# Altium project CATS-Vega.PrjPcb
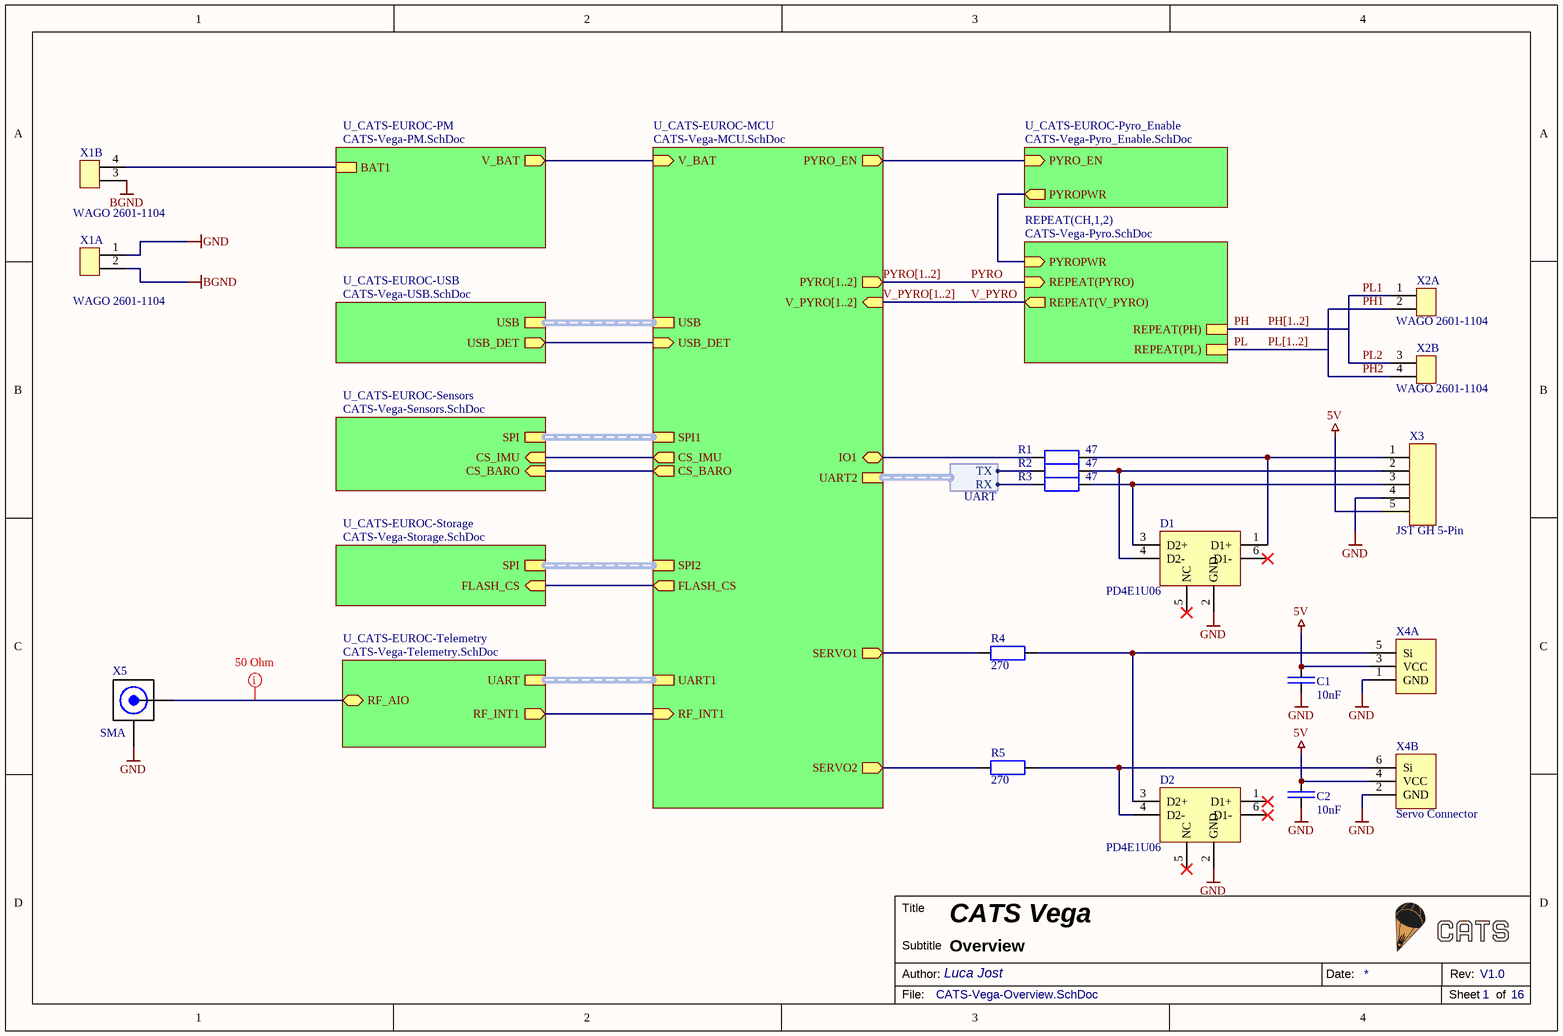
[diagram p0: CATS-Vega-Overview.SchDoc]
16 sheets, 177 parts. Net scope: hierarchical (ports join the sheet entries above them; power ports are global).
Board files: CATS-Vega.PcbDoc, CATS-Vega-Nutzen.PcbDoc
Sheets:
  CATS-Vega-Overview.SchDoc
    U_CATS-EUROC-Sensors = CATS-Vega-Sensors.SchDoc
      U_CATS-EUROC-IMU = CATS-Vega-IMU.SchDoc
      U_CATS-EUROC-Baro = CATS-Vega-Baro.SchDoc
    U_CATS-EUROC-MCU = CATS-Vega-MCU.SchDoc
    CH1 = CATS-Vega-Pyro.SchDoc
    CH2 = CATS-Vega-Pyro.SchDoc
    U_CATS-EUROC-USB = CATS-Vega-USB.SchDoc
    U_CATS-EUROC-Pyro_Enable = CATS-Vega-Pyro_Enable.SchDoc
    U_CATS-EUROC-Storage = CATS-Vega-Storage.SchDoc
    U_CATS-EUROC-PM = CATS-Vega-PM.SchDoc
    U_CATS-EUROC-Telemetry = CATS-Vega-Telemetry.SchDoc
      U_MCU = CATS-Vega-Radio_MCU.SchDoc
      U_RF = CATS-Vega-RF.SchDoc
        U_Frontend = CATS-Vega-Frontend.SchDoc
        U_Radio = CATS-Vega-Radio.SchDoc
      U_GNSS = CATS-Vega-GNSS.SchDoc

## Sheet CATS-Vega-Overview.SchDoc: CATS Vega
size A4; DocumentNumber: Overview; Revision: V1.0; SheetNumber: 1; SheetTotal: 16; Author: Luca Jost; Subtitle: Overview

### Parts
C1  10nF  [SMD Keramikkondensator 0603]
C2  10nF  [SMD Keramikkondensator 0603]
D1  PD4E1U06  [SMD IC SOT-363 (SC-70-6)]
D2  PD4E1U06  [SMD IC SOT-363 (SC-70-6)]
R1  47  [SMD Widerstand 0603]
R2  47  [SMD Widerstand 0603]
R3  47  [SMD Widerstand 0603]
R4  270  [SMD Widerstand 0603]
R5  270  [SMD Widerstand 0603]
X1  WAGO 2601-1104  [THT PCB Terminal WAGO 2601-1104]  (parts A,B of 2)
X2  WAGO 2601-1104  [THT PCB Terminal WAGO 2601-1104]  (parts A,B of 2)
X3  JST GH 5-Pin  [SMD Connector JST GH-5]
X4  Servo Connector  [THT Stiftleiste 6-Pol (2x3) 90°]  (value not drawn)  (parts A,B of 2)
X5  SMA  [THT Buchse SMA Female]

### Sub-sheets
REPEAT(CH,1,2) = CATS-Vega-Pyro.SchDoc: REPEAT(V_PYRO) (out), REPEAT(PYRO) (in), REPEAT(PH), REPEAT(PL), PYROPWR (in)
U_CATS-EUROC-MCU = CATS-Vega-MCU.SchDoc: SPI1 (harness SPI), UART1 (harness UART), USB (harness USB), V_PYRO[1..2] (in), PYRO[1..2] (out), IO1 (bidir), SERVO1 (out), SERVO2 (out), USB_DET (in), V_BAT (in), CS_IMU (out), CS_BARO (out), RF_INT1 (in), PYRO_EN (out), SPI2 (harness SPI), FLASH_CS (out), UART2 (harness UART)
U_CATS-EUROC-PM = CATS-Vega-PM.SchDoc: V_BAT (out), BAT1
U_CATS-EUROC-Pyro_Enable = CATS-Vega-Pyro_Enable.SchDoc: PYRO_EN (in), PYROPWR (out)
U_CATS-EUROC-Sensors = CATS-Vega-Sensors.SchDoc: CS_IMU (in), SPI, CS_BARO (in)
U_CATS-EUROC-Storage = CATS-Vega-Storage.SchDoc: SPI (harness SPI), FLASH_CS (in)
U_CATS-EUROC-Telemetry = CATS-Vega-Telemetry.SchDoc: UART, RF_INT1 (out), RF_AIO (bidir)
U_CATS-EUROC-USB = CATS-Vega-USB.SchDoc: USB (harness USB), USB_DET (out)

### Harnesses
UART: TX, RX

### Nets
5V: C1.2 C2.2 X3.5 X4.3(VCC) X4.4(VCC)
BGND: X1.2 X1.3
GND: C1.1 C2.1 D1.2(GND) D2.2(GND) X1.1 X3.4 X4.1(GND) X4.2(GND) X5.2(RF)
CS_BARO: sheet U_CATS-EUROC-Sensors/CS_BARO, sheet U_CATS-EUROC-MCU/CS_BARO
CS_IMU: sheet U_CATS-EUROC-Sensors/CS_IMU, sheet U_CATS-EUROC-MCU/CS_IMU
FLASH_CS: sheet U_CATS-EUROC-MCU/FLASH_CS, sheet U_CATS-EUROC-Storage/FLASH_CS
INT1: sheet U_CATS-EUROC-MCU/RF_INT1, sheet U_CATS-EUROC-Telemetry/RF_INT1
IO1: R1.1 ; sheet U_CATS-EUROC-MCU/IO1
PH: sheet REPEAT(CH,1,2)/REPEAT(PH)
PH1: X2.2 X2.4 ; sheet REPEAT(CH,1,2)/PYROPWR, sheet U_CATS-EUROC-Pyro_Enable/PYROPWR  [also labelled PH2]
PL: sheet REPEAT(CH,1,2)/REPEAT(PL)
PL1: X2.1
PL2: X2.3
PYRO: sheet REPEAT(CH,1,2)/REPEAT(PYRO)
PYRO_EN: sheet U_CATS-EUROC-MCU/PYRO_EN, sheet U_CATS-EUROC-Pyro_Enable/PYRO_EN
SERVO1: R4.1 ; sheet U_CATS-EUROC-MCU/SERVO1
SERVO2: R5.1 ; sheet U_CATS-EUROC-MCU/SERVO2
UART2_RX: R3.1 ; sheet U_CATS-EUROC-MCU/UART2.RX
UART2_TX: R2.1 ; sheet U_CATS-EUROC-MCU/UART2.TX
USB_DET: sheet U_CATS-EUROC-MCU/USB_DET, sheet U_CATS-EUROC-USB/USB_DET
V_BAT: sheet U_CATS-EUROC-MCU/V_BAT, sheet U_CATS-EUROC-PM/V_BAT
V_PYRO: sheet REPEAT(CH,1,2)/REPEAT(V_PYRO)
NetC30_2: X1.4 ; sheet U_CATS-EUROC-PM/BAT1
NetD1_1: D1.1(D1+) R1.2 X3.1
NetD1_3: D1.3(D2+) R3.2 X3.3
NetD1_4: D1.4(D2-) R2.2 X3.2
NetD2_3: D2.3(D2+) R4.2 X4.5(Si)
NetD2_4: D2.4(D2-) R5.2 X4.6(Si)
NetFL1_3: X5.1(RF) ; sheet U_CATS-EUROC-Telemetry/RF_AIO

Not connected (* = marked no-connect by the designer): D1 5(NC)* 6(D1-)*; D2 1(D1+)* 5(NC)* 6(D1-)*

### Buses and harness runs
bus PH[1..2]
bus PL[1..2]
bus PYRO[1..2] = sheet U_CATS-EUROC-MCU/PYRO[1..2]
bus V_PYRO[1..2] = sheet U_CATS-EUROC-MCU/V_PYRO[1..2]
harness sheet U_CATS-EUROC-MCU/SPI1 = sheet U_CATS-EUROC-Sensors/SPI
harness sheet U_CATS-EUROC-MCU/SPI2 = sheet U_CATS-EUROC-Storage/SPI
harness sheet U_CATS-EUROC-MCU/UART1 = sheet U_CATS-EUROC-Telemetry/UART
harness sheet U_CATS-EUROC-MCU/USB = sheet U_CATS-EUROC-USB/USB

### Layout directives
rule Impedance Constraint [Min = 50.00    Max = 50.00    ]; net class RF-Line 50: NetFL1_3

### Notes on the sheet
- Title
- Author:
- Subtitle
- Date:
- Rev:
- File:
- Sheet
- of

### Library data of the parts
C1 C2 = E6 - 10nF: SMD Ceramic Capacitor E6; Unit Price: 0.0015; JLC: C1589
D1 D2 = PD4E1U06DCKR: Unidirectional 3A (8/20us) 15V (Typ) 6.5V 5.5V (Max) SOT-363 ESD Protection Devices ROHS; ComponentLink1Description: Datasheet; ComponentLink1URL: https://datasheet.lcsc.com/lcsc/1810172210_Texas-Instruments-TPD4E1U06DCKR_C194628.pdf; Digikey: 296-39347-1-ND; Farnell: 3116516; JLC: C194628; Mouser: 595-TPD4E1U06DCKR; Unit Price: 0.0382
R1-R3 = E24 - 47: SMD Chip Resistor E24; Unit Price: 0.001; JLC: C1211
R4 R5 = E24 - 270: SMD Chip Resistor E24; Unit Price: 0.001; JLC: C22966
X1 X2 = WAGO 2601-1104: PCB terminal blocks with levers and Push-in CAGE CLAMP® connection; ComponentLink1Description: Datasheet; ComponentLink1URL: https://www.wago.com/us/pcb-interconnect/pcb-terminal-block/p/2604-1106
X3 = JST GH 5-Pin: Connector Header Surface Mount, Right Angle 4 position 0.049" (1.25mm); ComponentLink1Description: Datasheet; ComponentLink1URL: https://www.jst-mfg.com/product/pdf/eng/eGH.pdf; JLC: C189896; Unit Price: 0.1871
X4 = Servo Connector Dual: 6 Pin header for PWM servos; JLC: C239334; Unit Price: 0.0962
X5 = SMA Connector: Female SMA Connector THT; Digikey: 931-1361-ND; JLC: C1509230; Unit Price: 0.4926

## Sheet CATS-Vega-Sensors.SchDoc: CATS Vega
size A4; DocumentNumber: Overview; Revision: V1.0; SheetNumber: 5; SheetTotal: 16; Author: Luca Jost; Subtitle: Sensors
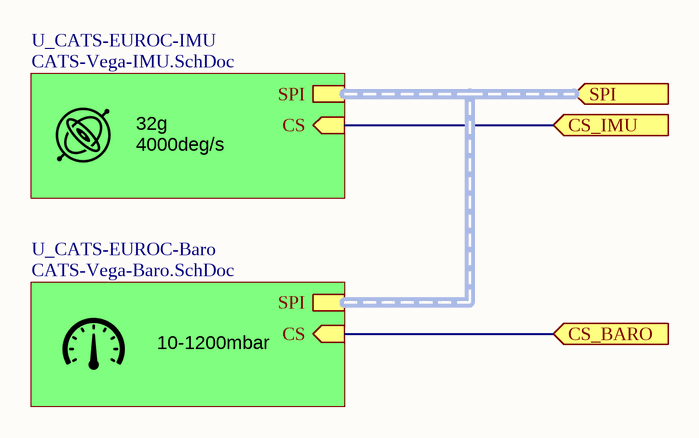
[diagram p1: CATS-Vega-Sensors.SchDoc]

### Sub-sheets
U_CATS-EUROC-Baro = CATS-Vega-Baro.SchDoc: SPI (harness SPI), CS (in)
U_CATS-EUROC-IMU = CATS-Vega-IMU.SchDoc: SPI (harness SPI), CS (in)

### Ports
CS_BARO (in), CS_IMU (in), SPI (in)

### Nets
CS_BARO: port CS_BARO, sheet U_CATS-EUROC-Baro/CS
CS_IMU: port CS_IMU, sheet U_CATS-EUROC-IMU/CS

### Buses and harness runs
harness port SPI = sheet U_CATS-EUROC-Baro/SPI = sheet U_CATS-EUROC-IMU/SPI

### Notes on the sheet
- 4000deg/s
- 32g
- 10-1200mbar
- Title
- Author:
- Subtitle
- Date:
- Rev:
- File:
- Sheet
- of

## Sheet CATS-Vega-IMU.SchDoc: CATS Vega
size A4; DocumentNumber: Overview; Revision: V1.0; SheetNumber: 6; SheetTotal: 16; Author: Luca Jost; Subtitle: Inertial Measurement Unit
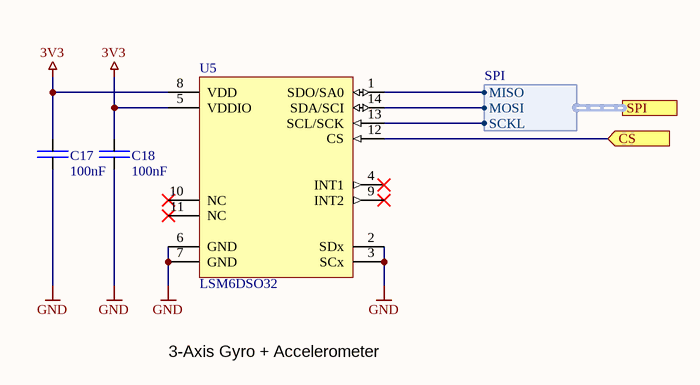
[diagram p2: CATS-Vega-IMU.SchDoc]

### Parts
C17  100nF  [SMD Keramikkondensator 0603]
C18  100nF  [SMD Keramikkondensator 0603]
U5  LSM6DSO32  [SMD IC LGA-14]

### Ports
CS (in), SPI (harness SPI)

### Harnesses
SPI: MISO, MOSI, SCKL

### Nets
3V3: C17.2 C18.2 U5.5(VDDIO) U5.8(VDD)
GND: C17.1 C18.1 U5.2(SDx) U5.3(SCx) U5.6(GND) U5.7(GND)
CS_IMU: U5.12(CS) ; port CS
SPI1_MISO: U5.1(SDO/SA0) ; port SPI.MISO
SPI1_MOSI: U5.14(SDA/SCI) ; port SPI.MOSI
SPI1_SCK: U5.13(SCL/SCK) ; port SPI.SCKL

Not connected (* = marked no-connect by the designer): U5 4(INT1)* 9(INT2)* 10(NC)* 11(NC)*

### Notes on the sheet
- 3-Axis Gyro + Accelerometer
- Title
- Author:
- Subtitle
- Date:
- Rev:
- File:
- Sheet
- of

### Library data of the parts
C17 C18 = E6 - 100nF: SMD Ceramic Capacitor E6; Unit Price: 0.0024; JLC: C1591
U5 = LSM6DSO32: iNEMO inertial module / ±4/±8/±16/±32 g / ±125/±250/±500/±1000/±2000 dps; ComponentLink1Description: Datasheet; ComponentLink1URL: https://www.st.com/resource/en/datasheet/lsm6dso32.pdf; Digikey: 497-LSM6DSO32CT-ND; Mouser: 511-LSM6DSO32TR; Farnell: 3527117; JLC: C1864162; Unit Price: 4.59

## Sheet CATS-Vega-Baro.SchDoc: CATS Vega
size A4; DocumentNumber: Overview; Revision: V1.0; SheetNumber: 7; SheetTotal: 16; Author: Luca Jost; Subtitle: Barometer
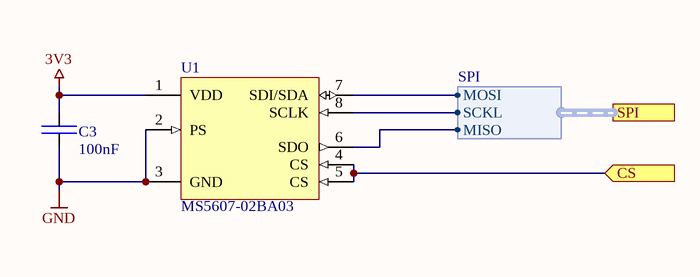
[diagram p3: CATS-Vega-Baro.SchDoc]

### Parts
C3  100nF  [SMD Keramikkondensator 0603]
U1  MS5607-02BA03  [SMD IC BARO MS5607]

### Ports
CS (in), SPI (harness SPI)

### Harnesses
SPI: SCKL, MOSI, MISO

### Nets
3V3: C3.2 U1.1(VDD)
GND: C3.1 U1.2(PS) U1.3(GND)
CS_BARO: U1.4(CS) U1.5(CS) ; port CS
SPI1_MISO: U1.6(SDO) ; port SPI.MISO
SPI1_MOSI: U1.7(SDI/SDA) ; port SPI.MOSI
SPI1_SCK: U1.8(SCLK) ; port SPI.SCKL

### Notes on the sheet
- Title
- Author:
- Subtitle
- Date:
- Rev:
- File:
- Sheet
- of

### Library data of the parts
C3 = E6 - 100nF: SMD Ceramic Capacitor E6; Unit Price: 0.0024; JLC: C1591
U1 = MS5607-02BA03: Barometric Pressure Sensor, with stainless / steel cap; ComponentLink1Description: Datasheet; ComponentLink1URL: https://www.te.com/commerce/DocumentDelivery/DDEController?Action=srchrtrv&DocNm=MS5607-02BA03&DocType=Data+Sheet&DocLang=English; Digikey: 223-1198-1-ND; Mouser: 824-MS560702BA03-50; Unit Price: 3.47

## Sheet CATS-Vega-MCU.SchDoc: CATS Vega
size A4; DocumentNumber: Overview; Revision: V1.1; SheetNumber: 2; SheetTotal: 16; Author: Luca Jost; Subtitle: Microcontroller
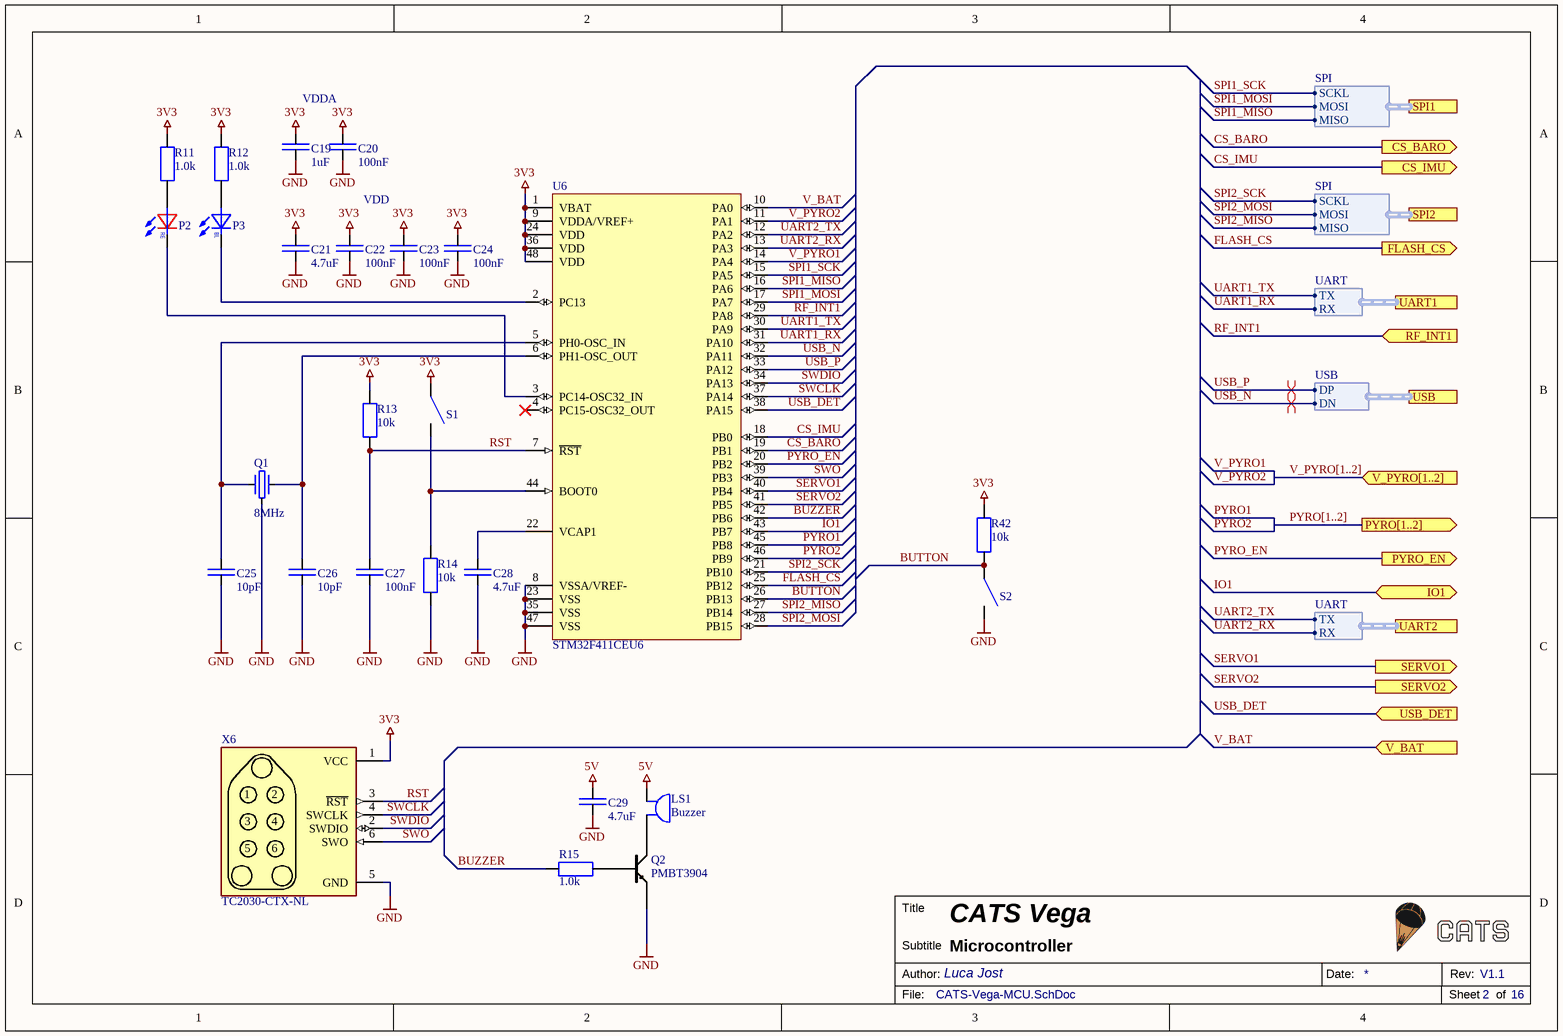
[diagram p4: CATS-Vega-MCU.SchDoc]

### Parts
C19  1uF  [SMD Keramikkondensator 0603]
C20  100nF  [SMD Keramikkondensator 0603]
C21  4.7uF  [SMD Keramikkondensator 0603]
C22  100nF  [SMD Keramikkondensator 0603]
C23  100nF  [SMD Keramikkondensator 0603]
C24  100nF  [SMD Keramikkondensator 0603]
C25  10pF  [SMD Keramikkondensator 0603]
C26  10pF  [SMD Keramikkondensator 0603]
C27  100nF  [SMD Keramikkondensator 0603]
C28  4.7uF  [SMD Keramikkondensator 0603]
C29  4.7uF  [SMD Keramikkondensator 0603]
LS1  Buzzer  [SMD BUZZER CMT-8504]
P2  LED  [SMD LED 0603]  (value not drawn)
P3  LED  [SMD LED 0603]  (value not drawn)
Q1  8MHz  [SMD Crystal 3.2X2.5X0.8]
Q2  PMBT3904  [SMD Transistor SOT-23]
R11  1.0k  [SMD Widerstand 0603]
R12  1.0k  [SMD Widerstand 0603]
R13  10k  [SMD Widerstand 0603]
R14  10k  [SMD Widerstand 0603]
R15  1.0k  [SMD Widerstand 0603]
R42  10k  [SMD Widerstand 0603]
S1  SMD-Button  [SMD Button 2.5x3x1.2]  (value not drawn)
S2  SMD-Button  [SMD Button 2.5x3x1.2]  (value not drawn)
U6  STM32F411CEU6  [SMD IC QFN-48]
X6  TC2030-CTX-NL  [SMD Connector TC2030]  (no BOM)

### Ports
CS_BARO (out), CS_IMU (out), FLASH_CS (out), IO1 (bidir), PYRO[1..2] (out), PYRO_EN (out), RF_INT1 (in), SERVO1 (out), SERVO2 (out), SPI1 (harness SPI), SPI2 (harness SPI), UART1 (harness UART), UART2 (harness UART), USB (harness USB), USB_DET (in), V_BAT (in), V_PYRO[1..2] (in)

### Harnesses
SPI: SCKL, MOSI, MISO
UART: TX, RX
USB: DP, DN

### Nets
3V3: C19.2 C20.2 C21.2 C22.2 C23.2 C24.2 R11.2 R12.2 R13.2 R42.2 S1.1 U6.1(VBAT) U6.9(VDDA/VREF+) U6.24(VDD) U6.36(VDD) U6.48(VDD) X6.1(VCC)
5V: C29.2 LS1.1
GND: C19.1 C20.1 C21.1 C22.1 C23.1 C24.1 C25.1 C26.1 C27.1 C28.1 C29.1 Q1.3 Q2.E R14.1 S2.2 U6.8(VSSA/VREF-) U6.23(VSS) U6.35(VSS) U6.47(VSS) X6.5(GND)
BUTTON: R42.1 S2.1 U6.26(PB13)
BUZZER: R15.2 U6.42(PB6)
CS_BARO: U6.19(PB1) ; port CS_BARO
CS_IMU: U6.18(PB0) ; port CS_IMU
FLASH_CS: U6.25(PB12) ; port FLASH_CS
IO1: U6.43(PB7) ; port IO1
PYRO1: U6.45(PB8)
PYRO2: U6.46(PB9)
PYRO_EN: U6.20(PB2) ; port PYRO_EN
RF_INT1: U6.29(PA8) ; port RF_INT1  [project net INT1]
RST: C27.2 R13.1 U6.7(~{RST}) X6.3(~{RST})
SERVO1: U6.40(PB4) ; port SERVO1
SERVO2: U6.41(PB5) ; port SERVO2
SPI1_MISO: U6.16(PA6) ; port SPI1.MISO
SPI1_MOSI: U6.17(PA7) ; port SPI1.MOSI
SPI1_SCK: U6.15(PA5) ; port SPI1.SCKL
SPI2_MISO: U6.27(PB14) ; port SPI2.MISO
SPI2_MOSI: U6.28(PB15) ; port SPI2.MOSI
SPI2_SCK: U6.21(PB10) ; port SPI2.SCKL
SWCLK: U6.37(PA14) X6.4(SWCLK)
SWDIO: U6.34(PA13) X6.2(SWDIO)
SWO: U6.39(PB3) X6.6(SWO)
UART1_RX: U6.31(PA10) ; port UART1.RX  [project net TX2]
UART1_TX: U6.30(PA9) ; port UART1.TX  [project net RX2]
UART2_RX: U6.13(PA3) ; port UART2.RX
UART2_TX: U6.12(PA2) ; port UART2.TX
USB_DET: U6.38(PA15) ; port USB_DET
USB_N: U6.32(PA11) ; port USB.DN
USB_P: U6.33(PA12) ; port USB.DP
V_BAT: U6.10(PA0) ; port V_BAT
V_PYRO1: U6.14(PA4)
V_PYRO2: U6.11(PA1)
NetC25_2: C25.2 Q1.1 U6.5(PH0-OSC_IN)
NetC26_2: C26.2 Q1.2 U6.6(PH1-OSC_OUT)
NetC28_2: C28.2 U6.22(VCAP1)
NetLS1_2: LS1.2 Q2.C
NetP2_A: P2.A R11.1
NetP2_K: P2.K U6.3(PC14-OSC32_IN)
NetP3_A: P3.A R12.1
NetP3_K: P3.K U6.2(PC13)
NetQ2_B: Q2.B R15.1
NetR14_2: R14.2 S1.2 U6.44(BOOT0)

Not connected (* = marked no-connect by the designer): U6 4(PC15-OSC32_OUT)*

### Buses and harness runs
bus PYRO[1..2] = port PYRO[1..2]
bus V_PYRO[1..2] = port V_PYRO[1..2]

### Layout directives
differential pair: USB_N, USB_P

### Notes on the sheet
- VDDA
- VDD
- Title
- Author:
- Subtitle
- Date:
- Rev:
- File:
- Sheet
- of
- (in symbol LED) BL; RE

### Library data of the parts
C19 = E6 - 1uF: SMD Ceramic Capacitor E6; Unit Price: 0.0047; JLC: C15849
C20 C22-C24 C27 = E6 - 100nF: SMD Ceramic Capacitor E6; Unit Price: 0.0024; JLC: C1591
C21 C28 C29 = E6 - 4.7uF: SMD Ceramic Capacitor E6; Unit Price: 0.0082; JLC: C19666
C25 C26 = E6 - 10pF: SMD Ceramic Capacitor E6; Unit Price: 0.0055; JLC: C1634
LS1 = Buzzer: Buzzers Indicator, Internally Driven Piezo 12V 10mA 3kHz 100dB @ 12V, 10cm Through Hole PC Pins; Digikey: 2603-CT08E-06S300-2TR-ND; ComponentLink1Description: Datasheet; ComponentLink1URL: https://datasheet.lcsc.com/lcsc/2001061407_INGHAi-GSC8530RA-16R2700_C255315.pdf; JLC: C255315; Unit Price: 0.4057
P2 P3 = LED: Color LED; Unit Price: 0.01
  P2: JLC: C84263
  P3: JLC: C434421
Q1 = Crystal: SMD Crystal Resonators 8MHz ±10ppm SMD,3.2x2.5mm; Digikey: 535-15255-1-ND; JLC: C2682775; ComponentLink1Description: Datasheet; ComponentLink1URL: https://datasheet.lcsc.com/lcsc/2106070434_Yangxing-Tech-X32258MOB4SI_C2682775.pdf; Mouser: 815-M8AIG-8-1ZT; Unit Price: 0.1431
Q2 = PMBT3904: 40 V, 200 mA NPN switching transisto; ComponentLink1Description: Datasheet; ComponentLink1URL: https://datasheet.lcsc.com/lcsc/2105201004_Nexperia-PMBT3904-215_C8667.pdf; JLC: C8667; Unit Price: 0.019
R11 R12 R15 = E24 - 1.0k: SMD Chip Resistor E24; Unit Price: 0.001; JLC: C2907113
R13 R14 R42 = E24 - 10k: SMD Chip Resistor E24; Unit Price: 0.001; JLC: C99198
S1 S2 = Button 3mmx2.5mm: Button SPST; Digikey: SW1020TR-ND; JLC: C128937; ComponentLink1Description: Datasheet; ComponentLink1URL: https://datasheet.lcsc.com/lcsc/2108131530_Korean-Hroparts-Elec-K2-1822SA-A3DW-06_C128937.pdf; Mouser: 653-B3U-1000P; Unit Price: 0.1654
U6 = STM32F411CEU6: ARM® Cortex®-M4 series Microcontroller IC 32-Bit 100MHz 512KB (512K x 8) FLASH 48-UFQFPN (7x7); Digikey: 497-14907-ND; JLC: C60420; ComponentLink1Description: Datasheet; ComponentLink1URL: https://datasheet.lcsc.com/lcsc/1809291612_STMicroelectronics-STM32F411CEU6_C60420.pdf; Unit Price: 5.0305
X6 = TC2030-CTX-NL: Tag-Connect for ARM-Cortex (6-Pin)

## Sheet CATS-Vega-Pyro.SchDoc: CATS Vega
size A4; DocumentNumber: Overview; Revision: V1.0; SheetNumber: 10; SheetTotal: 16; Author: Luca Jost; Subtitle: Pyro Channel
Used 2 times, as channels CH1, CH2. Parts and nets are listed once, with the designators drawn on the sheet.
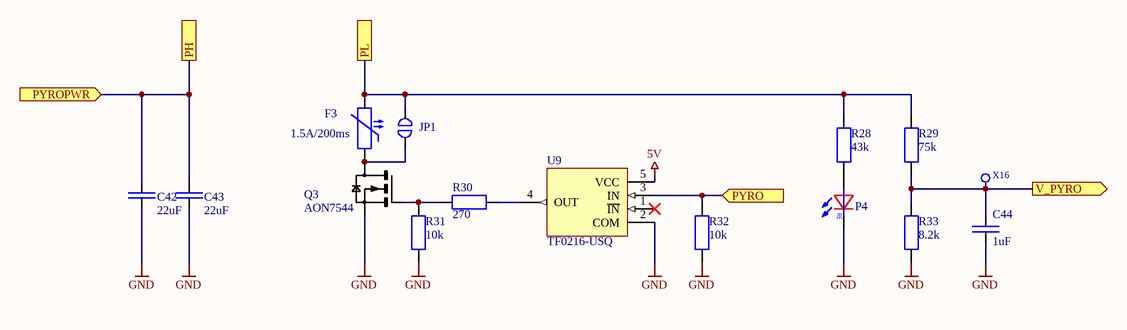
[diagram p5: CATS-Vega-Pyro.SchDoc]

### Parts
C42  22uF  [SMD Keramikkondensator 0805]
C43  22uF  [SMD Keramikkondensator 0805]
C44  1uF  [SMD Keramikkondensator 0603]
F3  1.5A/200ms  [SMD PPTC-Fuse 1206]
JP1  Jumper  [SMD Solder Jumper 1x2mm]  (value not drawn)  (no BOM)
P4  LED  [SMD LED 0603]  (value not drawn)
Q3  AON7544  [SMD MOSFET DFN 3x3 EP]
R28  43k  [SMD Widerstand 0603]
R29  75k  [SMD Widerstand 0603]
R30  270  [SMD Widerstand 0603]
R31  10k  [SMD Widerstand 0603]
R32  10k  [SMD Widerstand 0603]
R33  8.2k  [SMD Widerstand 0603]
U9  TF0216-USQ  [SMD IC SOT-23-5]
X16  -  [SMD Test point 0.8mm]  (value not drawn)  (no BOM)

### Ports
PH, PL, PYRO (in), PYROPWR (in), V_PYRO (out)

### Nets
5V: U9.5(VCC)
GND: C42.1 C43.1 C44.1 P4.K Q3.S R31.1 R32.1 R33.1 U9.2(COM)
PH: C42.2 C43.2 ; port PH, port PYROPWR
PL: F3.1 JP1.1 R28.2 R29.2 ; port PL
PYRO: R32.2 U9.3(IN) ; port PYRO
V_PYRO: C44.2 R29.1 R33.2 X16.1 ; port V_PYRO
NetF3_2: F3.2 JP1.2 Q3.D
NetP4_A: P4.A R28.1
NetQ3_G: Q3.G R30.1 R31.2
NetR30_2: R30.2 U9.4(OUT)

Not connected (* = marked no-connect by the designer): U9 1(~{IN})*

### Channels
CH1: designators end in _CH1; ports PH=PH1 PL=PL1 PYRO=PYRO1 PYROPWR=PH1 V_PYRO=V_PYRO1
CH2: designators end in _CH2; ports PH=PH1 PL=PL2 PYRO=PYRO2 PYROPWR=PH1 V_PYRO=V_PYRO2

### Notes on the sheet
- Title
- Author:
- Subtitle
- Date:
- Rev:
- File:
- Sheet
- of
- (in symbol LED) RE

### Library data of the parts
C42 C43 = E6 - 22uF: SMD Ceramic Capacitor E6; Unit Price: 0.3453; JLC: C338080
C44 = E6 - 1uF: SMD Ceramic Capacitor E6; Unit Price: 0.0047; JLC: C15849
F3 = ASMD1206-075-30V: Polymeric PTC Resettable Fuse 30V 0.75A Surface Mount 1206; ComponentLink1Description: Datasheet; ComponentLink1URL: https://datasheet.lcsc.com/lcsc/2204011730_Shenzhen-JDT-Fuse-ASMD1206-075-30V_C2982268.pdf; JLC: C2982268; Unit Price: 0.0525
JP1 = Jumper-1: Single Position Jumper
P4 = LED: Color LED; JLC: C84263; Unit Price: 0.01
Q3 = AON7544: N-Channel 30V 30A Surface Mount 8-DFN (3x3); ComponentLink1Description: Datasheet; ComponentLink1URL: https://datasheet.lcsc.com/lcsc/1912111437_Alpha---Omega-Semicon-AON7544_C315567.pdf; JLC: C315567; Digikey: 785-1634-2-ND; Unit Price: 0.1553
R28 = E24 - 43k: SMD Chip Resistor E24; Unit Price: 0.001; JLC: C23172
R29 = E24 - 75k: SMD Chip Resistor E24; Unit Price: 0.001; JLC: C23242
R30 = E24 - 270: SMD Chip Resistor E24; Unit Price: 0.001; JLC: C22966
R31 R32 = E24 - 10k: SMD Chip Resistor E24; Unit Price: 0.001; JLC: C99198
R33 = E24 - 8.2k: SMD Chip Resistor E24; Unit Price: 0.001; JLC: C168409
U9 = TF0216-USQ: SOT-23-5L Gate Drive IC; JLC: C2683769; ComponentLink1Description: Datasheet; ComponentLink1URL: https://datasheet.lcsc.com/lcsc/2106070334_TFSS-TF0216-USQ_C2683769.pdf; Unit Price: 0.3357
X16 = SMD Test point: Test Point SMD

## Sheet CATS-Vega-USB.SchDoc: CATS Vega
size A4; DocumentNumber: Overview; Revision: V1.0; SheetNumber: 4; SheetTotal: 16; Author: Luca Jost; Subtitle: USB Connector
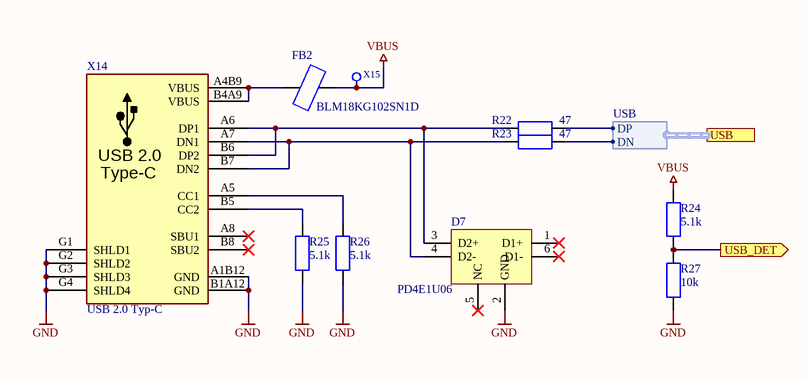
[diagram p6: CATS-Vega-USB.SchDoc]

### Parts
D7  PD4E1U06  [SMD IC SOT-363 (SC-70-6)]
FB2  BLM18KG102SN1D  [SMD Ferrite Bead 0603]
R22  47  [SMD Widerstand 0603]
R23  47  [SMD Widerstand 0603]
R24  5.1k  [SMD Widerstand 0603]
R25  5.1k  [SMD Widerstand 0603]
R26  5.1k  [SMD Widerstand 0603]
R27  10k  [SMD Widerstand 0603]
X14  USB 2.0 Typ-C  [THT USB-C Socket (A40-00119)]
X15  -  [SMD Test point 0.8mm]  (value not drawn)  (no BOM)

### Ports
USB (harness USB), USB_DET (out)

### Harnesses
USB: DP, DN

### Nets
GND: D7.2(GND) R25.1 R26.1 R27.2 X14.A1B12(GND) X14.B1A12(GND) X14.G1(SHLD1) X14.G2(SHLD2) X14.G3(SHLD3) X14.G4(SHLD4)
VBUS: FB2.1 R24.1 X15.1
USB_DET: R24.2 R27.1 ; port USB_DET
USB_N: R23.2 ; port USB.DN
USB_P: R22.2 ; port USB.DP
NetD7_3: D7.3(D2+) R22.1 X14.A6(DP1) X14.B6(DP2)
NetD7_4: D7.4(D2-) R23.1 X14.A7(DN1) X14.B7(DN2)
NetFB2_2: FB2.2 X14.A4B9(VBUS) X14.B4A9(VBUS)
NetR25_2: R25.2 X14.B5(CC2)
NetR26_2: R26.2 X14.A5(CC1)

Not connected (* = marked no-connect by the designer): D7 1(D1+)* 5(NC)* 6(D1-)*; X14 A8(SBU1)* B8(SBU2)*

### Notes on the sheet
- Title
- Author:
- Subtitle
- Date:
- Rev:
- File:
- Sheet
- of
- (in symbol USB Type-C USB 2.0) USB 2.0; Type-C

### Library data of the parts
D7 = PD4E1U06DCKR: as D1 on sheet CATS-Vega-Overview; ComponentLink1Description: Datasheet; ComponentLink1URL: https://datasheet.lcsc.com/lcsc/1810172210_Texas-Instruments-TPD4E1U06DCKR_C194628.pdf; Digikey: 296-39347-1-ND; Farnell: 3116516; JLC: C194628; Mouser: 595-TPD4E1U06DCKR; Unit Price: 0.0382
FB2 = BLM18KG102SN1D: 1 kOhms @ 100MHz 1 Power Line Ferrite Bead 0603 (1608 Metric) 1A 200mOhm; ComponentLink1Description: Datasheet; ComponentLink1URL: https://www.murata.com/en-us/products/productdata/8796738650142/ENFA0003.pdf; Digikey: 490-17349-1-ND; JLC: C42102; Unit Price: 0.0058
R22 R23 = E24 - 47: SMD Chip Resistor E24; Unit Price: 0.001; JLC: C1211
R24-R26 = E24 - 5.1k: SMD Chip Resistor E24; Unit Price: 0.001; JLC: C2907114
R27 = E24 - 10k: SMD Chip Resistor E24; Unit Price: 0.001; JLC: C99198
X14 = USB Type-C USB 2.0: Typ-C; Digikey: 2073-USB4105-GF-ACT-ND; Farnell: 3583366; JLC: C167321; Unit Price: 0.2741
X15 = SMD Test point: Test Point SMD

## Sheet CATS-Vega-Pyro_Enable.SchDoc: CATS Vega
size A4; DocumentNumber: Overview; Revision: V1.0; SheetNumber: 9; SheetTotal: 16; Author: Luca Jost; Subtitle: Pyro Power Enable
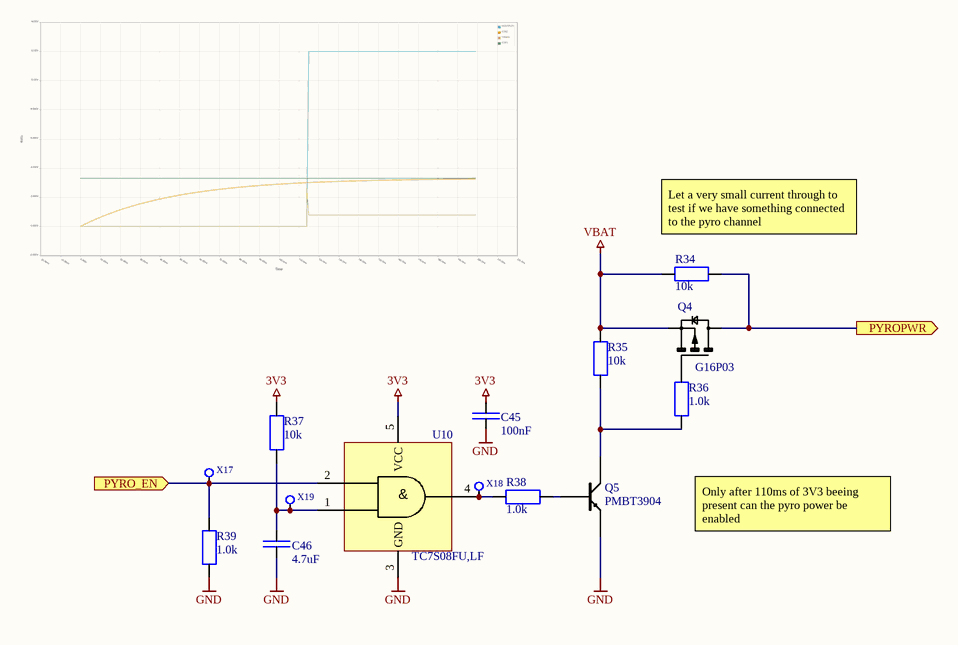
[diagram p7: CATS-Vega-Pyro_Enable.SchDoc]

### Parts
C45  100nF  [SMD Keramikkondensator 0603]
C46  4.7uF  [SMD Keramikkondensator 0603]
Q4  G16P03  [SMD MOSFET DFN 3x3 EP]
Q5  PMBT3904  [SMD Transistor SOT-23]
R34  10k  [SMD Widerstand 0603]
R35  10k  [SMD Widerstand 0603]
R36  1.0k  [SMD Widerstand 0603]
R37  10k  [SMD Widerstand 0603]
R38  1.0k  [SMD Widerstand 0603]
R39  1.0k  [SMD Widerstand 0603]
U10  TC7S08FU,LF  [SMD IC SSOP5-P-0.65A (SOT353-1)]
X17  -  [SMD Test point 0.8mm]  (value not drawn)  (no BOM)
X18  -  [SMD Test point 0.8mm]  (value not drawn)  (no BOM)
X19  -  [SMD Test point 0.8mm]  (value not drawn)  (no BOM)

### Ports
PYRO_EN (in), PYROPWR (out)

### Nets
3V3: C45.2 R37.2 U10.5(VCC)
GND: C45.1 C46.1 Q5.E R39.1 U10.3(GND)
VBAT: Q4.S R34.2 R35.2
PH1: Q4.D R34.1 ; port PYROPWR
PYRO_EN: R39.2 U10.2(IN) X17.1 ; port PYRO_EN
NetC46_2: C46.2 R37.1 U10.1(IN) X19.1
NetQ4_G: Q4.G R36.2
NetQ5_B: Q5.B R38.1
NetQ5_C: Q5.C R35.1 R36.1
NetR38_2: R38.2 U10.4(OUT) X18.1

### Notes on the sheet
- (near R34) Let a very small current through to test if we have something connected to the pyro channel
- Only after 110ms of 3V3 beeing present can the pyro power be enabled
- Title
- Author:
- Subtitle
- Date:
- Rev:
- File:
- Sheet
- of
- (in symbol TC7S08FU,LF) &

### Library data of the parts
C45 = E6 - 100nF: SMD Ceramic Capacitor E6; Unit Price: 0.0024; JLC: C1591
C46 = E6 - 4.7uF: SMD Ceramic Capacitor E6; Unit Price: 0.0082; JLC: C19666
Q4 = G16P03: 30V 16A 35W; ComponentLink1Description: Datasheet; ComponentLink1URL: https://datasheet.lcsc.com/lcsc/1809251724_GOFORD-G16P03_C193982.pdf; JLC: C471913; Unit Price: 0.1535
Q5 = PMBT3904: 40 V, 200 mA NPN switching transisto; ComponentLink1Description: Datasheet; ComponentLink1URL: https://datasheet.lcsc.com/lcsc/2105201004_Nexperia-PMBT3904-215_C8667.pdf; JLC: C8667; Unit Price: 0.019
R34 R35 R37 = E24 - 10k: SMD Chip Resistor E24; Unit Price: 0.001; JLC: C99198
R36 R38 R39 = E24 - 1.0k: SMD Chip Resistor E24; Unit Price: 0.001; JLC: C2907113
U10 = TC7S08FU,LF: AND Gate SSOP5-P-0.65A; ComponentLink1Description: Datasheet; ComponentLink1URL: https://datasheet.lcsc.com/lcsc/1811082031_TOSHIBA-TC7S08FU-LF_C146362.pdf; JLC: C146362; Unit Price: 0.1716
X17-X19 = SMD Test point: Test Point SMD

## Sheet CATS-Vega-Storage.SchDoc: CATS Vega
size A4; DocumentNumber: Overview; Revision: V1.0; SheetNumber: 8; SheetTotal: 16; Author: Luca Jost; Subtitle: Storage
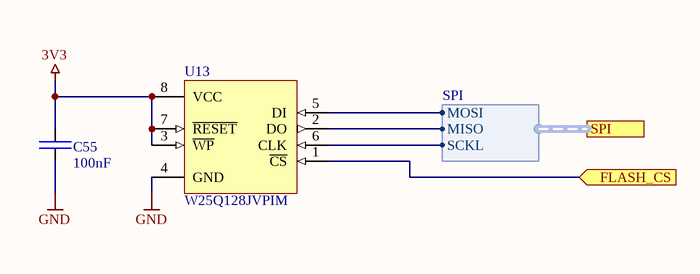
[diagram p8: CATS-Vega-Storage.SchDoc]

### Parts
C55  100nF  [SMD Keramikkondensator 0603]
U13  W25Q128JVPIM  [SMD IC WSON-8 (6x5)]

### Ports
FLASH_CS (in), SPI (harness SPI)

### Harnesses
SPI: SCKL, MOSI, MISO

### Nets
3V3: C55.2 U13.3(~{WP}) U13.7(~{RESET}) U13.8(VCC)
GND: C55.1 U13.4(GND)
FLASH_CS: U13.1(~{CS}) ; port FLASH_CS
SPI2_MISO: U13.2(DO) ; port SPI.MISO
SPI2_MOSI: U13.5(DI) ; port SPI.MOSI
SPI2_SCK: U13.6(CLK) ; port SPI.SCKL

### Notes on the sheet
- Title
- Author:
- Subtitle
- Date:
- Rev:
- File:
- Sheet
- of

### Library data of the parts
C55 = E6 - 100nF: SMD Ceramic Capacitor E6; Unit Price: 0.0024; JLC: C1591
U13 = W25Q128JVPIM: 3V 128M-BIT / SERIAL FLASH MEMORY WITH / DUAL/QUAD SPI & QPI & DTR; ComponentLink1Description: Datasheet; ComponentLink1URL: https://www.winbond.com/resource-files/w25q128jv_dtr%20revc%2003272018%20plus.pdf; Digikey: W25Q128JVPIM-ND; JLC: C190862; Unit Price: 0.8798

## Sheet CATS-Vega-PM.SchDoc: CATS Vega
size A4; DocumentNumber: Overview; Revision: V1.0; SheetNumber: 3; SheetTotal: 16; Author: Luca Jost; Subtitle: Power Management
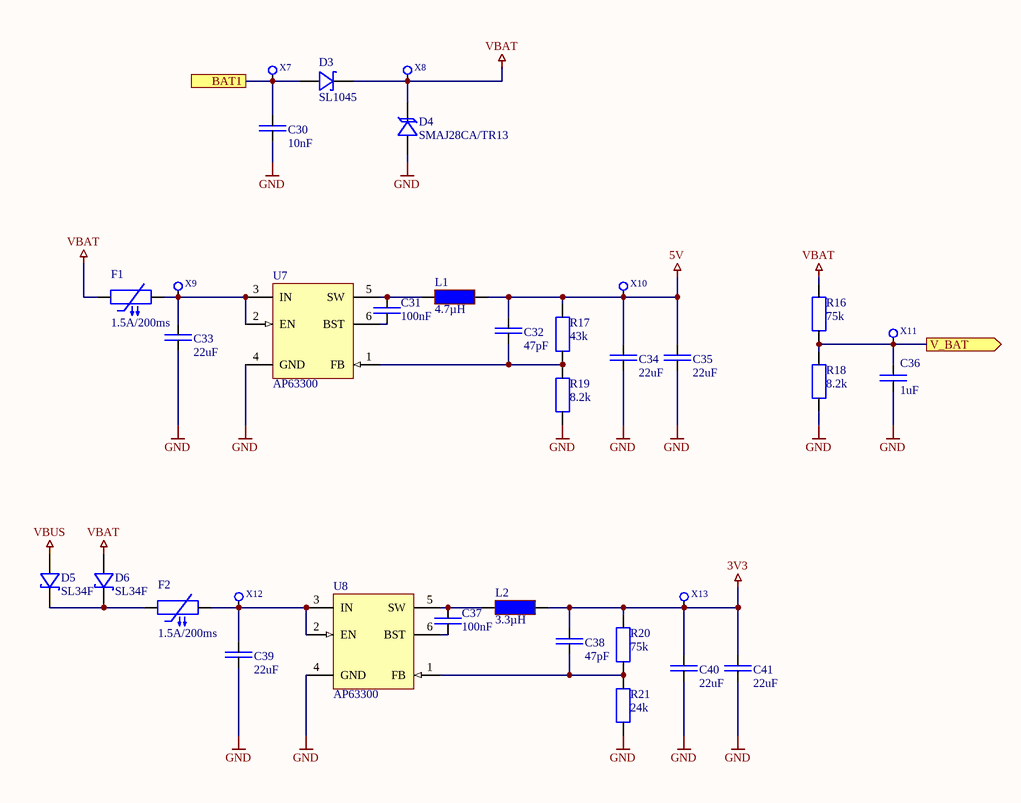
[diagram p9: CATS-Vega-PM.SchDoc]

### Parts
C30  10nF  [SMD Keramikkondensator 0603]
C31  100nF  [SMD Keramikkondensator 0603]
C32  47pF  [SMD Keramikkondensator 0603]
C33  22uF  [SMD Keramikkondensator 0805]
C34  22uF  [SMD Keramikkondensator 0805]
C35  22uF  [SMD Keramikkondensator 0805]
C36  1uF  [SMD Keramikkondensator 0603]
C37  100nF  [SMD Keramikkondensator 0603]
C38  47pF  [SMD Keramikkondensator 0603]
C39  22uF  [SMD Keramikkondensator 0805]
C40  22uF  [SMD Keramikkondensator 0805]
C41  22uF  [SMD Keramikkondensator 0805]
D3  SL1045  [SMD Diode TO-277]
D4  SMAJ28CA/TR13  [SMD Diode DO-214-AC (SMA)]
D5  SL34F  [SMD Diode SMAF]
D6  SL34F  [SMD Diode SMAF]
F1  1.5A/200ms  [SMD PPTC-Fuse 1206]
F2  1.5A/200ms  [SMD PPTC-Fuse 1206]
L1  4.7µH  [SMD Inductor 5.5x5.2x3]
L2  3.3µH  [SMD Inductor 2x2.5x1.2]
R16  75k  [SMD Widerstand 0603]
R17  43k  [SMD Widerstand 0603]
R18  8.2k  [SMD Widerstand 0603]
R19  8.2k  [SMD Widerstand 0603]
R20  75k  [SMD Widerstand 0603]
R21  24k  [SMD Widerstand 0603]
U7  AP63300  [SMD IC TSOT-23-6]
U8  AP63300  [SMD IC TSOT-23-6]
X7  -  [SMD Test point 0.8mm]  (value not drawn)  (no BOM)
X8  -  [SMD Test point 0.8mm]  (value not drawn)  (no BOM)
X9  -  [SMD Test point 0.8mm]  (value not drawn)  (no BOM)
X10  -  [SMD Test point 0.8mm]  (value not drawn)  (no BOM)
X11  -  [SMD Test point 0.8mm]  (value not drawn)  (no BOM)
X12  -  [SMD Test point 0.8mm]  (value not drawn)  (no BOM)
X13  -  [SMD Test point 0.8mm]  (value not drawn)  (no BOM)

### Ports
BAT1, V_BAT (out)

### Nets
3V3: C38.2 C40.2 C41.2 L2.2 R20.2 X13.1
5V: C32.2 C34.2 C35.2 L1.2 R17.2 X10.1
GND: C30.1 C33.1 C34.1 C35.1 C36.1 C39.1 C40.1 C41.1 D4.A R18.1 R19.1 R21.1 U7.4(GND) U8.4(GND)
VBAT: D3.K D4.K D6.A F1.2 R16.2 X8.1
VBUS: D5.A
V_BAT: C36.2 R16.1 R18.2 X11.1 ; port V_BAT
NetC30_2: C30.2 D3.A X7.1 ; port BAT1
NetC31_1: C31.1 U7.6(BST)
NetC31_2: C31.2 L1.1 U7.5(SW)
NetC32_1: C32.1 R17.1 R19.2 U7.1(FB)
NetC33_2: C33.2 F1.1 U7.2(EN) U7.3(IN) X9.1
NetC37_1: C37.1 U8.6(BST)
NetC37_2: C37.2 L2.1 U8.5(SW)
NetC38_1: C38.1 R20.1 R21.2 U8.1(FB)
NetC39_2: C39.2 F2.1 U8.2(EN) U8.3(IN) X12.1
NetD5_K: D5.K D6.K F2.2

### Notes on the sheet
- Title
- Author:
- Subtitle
- Date:
- Rev:
- File:
- Sheet
- of

### Library data of the parts
C30 = E6 - 10nF: SMD Ceramic Capacitor E6; Unit Price: 0.0015; JLC: C1589
C31 C37 = E6 - 100nF: SMD Ceramic Capacitor E6; Unit Price: 0.0024; JLC: C1591
C32 C38 = E6 - 47pF: SMD Ceramic Capacitor E6; Unit Price: 0.0056; JLC: C1671
C33-C35 C39-C41 = E6 - 22uF: SMD Ceramic Capacitor E6; Unit Price: 0.3453; JLC: C338080
C36 = E6 - 1uF: SMD Ceramic Capacitor E6; Unit Price: 0.0047; JLC: C15849
D3 = SL1045: 45V 470mV@10A 10A TO-277 Schottky Barrier Diodes; ComponentLink1Description: Datasheet; ComponentLink1URL: https://datasheet.lcsc.com/lcsc/1810252210_MDD-Microdiode-Electronics--SL1045_C65021.pdf; JLC: C113945; Unit Price: 0.1199
D4 = SMAJ28CA/TR13: TVS Diode, 31.10~34.40V Breakdown, 8.8A Pulse; ComponentLink1Description: Datasheet; ComponentLink1URL: https://datasheet.lcsc.com/lcsc/1809291411_Brightking-SMAJ28CA-TR13_C90508.pdf; JLC: C90508; Unit Price: 0.0337
D5 D6 = SL34F: 3A SMAF Schottky Barrier Diode; JLC: C60396; ComponentLink1Description: Datasheet; ComponentLink1URL: https://datasheet.lcsc.com/lcsc/1809211527_MDD-Microdiode-Electronics--SL34F_C113938.pdf; Unit Price: 0.0363
F1 F2 = ASMD1206-075-30V: as F3 on sheet CATS-Vega-Pyro; ComponentLink1Description: Datasheet; ComponentLink1URL: https://datasheet.lcsc.com/lcsc/2204011730_Shenzhen-JDT-Fuse-ASMD1206-075-30V_C2982268.pdf; JLC: C2982268; Unit Price: 0.0525
L1 = Inductor 4.7µH / 4.5A: 4.7 µH Shielded Molded Inductor 4.5 A 60mOhm Max Nonstandard; Digikey: 541-1238-2-ND; ComponentLink1Description: Datasheet; ComponentLink1URL: https://www.vishay.com/docs/34260/ihlp2020cz11.pdf; JLC: C408410; Unit Price: 0.0978
L2 = Inductor 3.3µH / 1.15A: 1.15A 3.3uH ±20% 144mΩ SMD Power Inductors; Digikey: 732-5680-2-ND; ComponentLink1Description: Datasheet; ComponentLink1URL: https://datasheet.lcsc.com/lcsc/2110081330_Sunlord-SPH252012H3R3MT_C98379.pdf; JLC: C98379; Unit Price: 0.0513
R16 R20 = E24 - 75k: SMD Chip Resistor E24; Unit Price: 0.001; JLC: C23242
R17 = E24 - 43k: SMD Chip Resistor E24; Unit Price: 0.001; JLC: C23172
R18 R19 = E24 - 8.2k: SMD Chip Resistor E24; Unit Price: 0.001; JLC: C168409
R21 = E24 - 24k: SMD Chip Resistor E24; Unit Price: 0.001; JLC: C2907131
U7 U8 = AP63300: 3.8V TO 32V INPUT, 3A LOW IQ SYNCHRONOUS BUCK WITH ENHANCED EMI REDUCTION; ComponentLink1Description: Datasheet; ComponentLink1URL: https://www.diodes.com/assets/Datasheets/AP63300-AP63301.pdf; Digikey: 31-AP63300WU-7TR-ND; JLC: C2158012; Mouser: 621-AP63300WU-7; Unit Price: 0.6396
X7-X13 = SMD Test point: Test Point SMD

## Sheet CATS-Vega-Telemetry.SchDoc: CATS Vega
size A4; Author: Luca Jost; Revision: V1.0; SheetNumber: 11; SheetTotal: 16; Subtitle: Telemetry
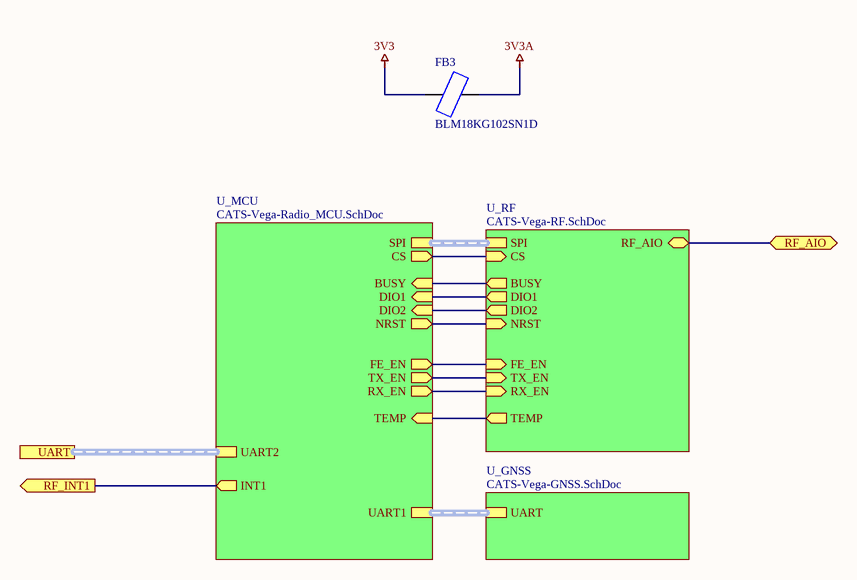
[diagram p10: CATS-Vega-Telemetry.SchDoc]

### Parts
FB3  BLM18KG102SN1D  [SMD Ferrite Bead 0603]

### Sub-sheets
U_GNSS = CATS-Vega-GNSS.SchDoc: UART (harness UART)
U_MCU = CATS-Vega-Radio_MCU.SchDoc: SPI (harness SPI), CS (out), FE_EN (out), TX_EN (out), BUSY (in), DIO1 (in), DIO2 (in), TEMP (in), UART1 (harness UART), UART2 (harness UART), RX_EN (out), INT1 (out), NRST (out)
U_RF = CATS-Vega-RF.SchDoc: SPI (harness SPI), CS (in), BUSY (out), DIO1 (out), DIO2 (out), TEMP (out), FE_EN (in), TX_EN (in), RX_EN (in), RF_AIO (bidir), NRST (in)

### Ports
RF_AIO (bidir), RF_INT1 (out), UART

### Nets
3V3: FB3.2
3V3A: FB3.1
BUSY: sheet U_MCU/BUSY, sheet U_RF/BUSY
CS: sheet U_MCU/CS, sheet U_RF/CS
DIO1: sheet U_MCU/DIO1, sheet U_RF/DIO1
FE_EN: sheet U_MCU/FE_EN, sheet U_RF/FE_EN
INT1: port RF_INT1, sheet U_MCU/INT1
NRST: sheet U_MCU/NRST, sheet U_RF/NRST
RX_EN: sheet U_MCU/RX_EN, sheet U_RF/RX_EN
TEMP: sheet U_MCU/TEMP, sheet U_RF/TEMP
TX_EN: sheet U_MCU/TX_EN, sheet U_RF/TX_EN
NetFL1_3: port RF_AIO, sheet U_RF/RF_AIO
(unnamed): sheet U_MCU/DIO2, sheet U_RF/DIO2

### Buses and harness runs
harness port UART = sheet U_MCU/UART2
harness sheet U_GNSS/UART = sheet U_MCU/UART1
harness sheet U_MCU/SPI = sheet U_RF/SPI

### Notes on the sheet
- Title
- Author:
- Subtitle
- Date:
- Rev:
- File:
- Sheet
- of

### Library data of the parts
FB3 = BLM18KG102SN1D: as FB2 on sheet CATS-Vega-USB; ComponentLink1Description: Datasheet; ComponentLink1URL: https://www.murata.com/en-us/products/productdata/8796738650142/ENFA0003.pdf; Digikey: 490-17349-1-ND; JLC: C42102; Unit Price: 0.0058

## Sheet CATS-Vega-Radio_MCU.SchDoc: CATS Vega
size A4; Author: Luca Jost; Revision: V1.0; SheetNumber: 12; SheetTotal: 16; Subtitle: Radio Microprocessor
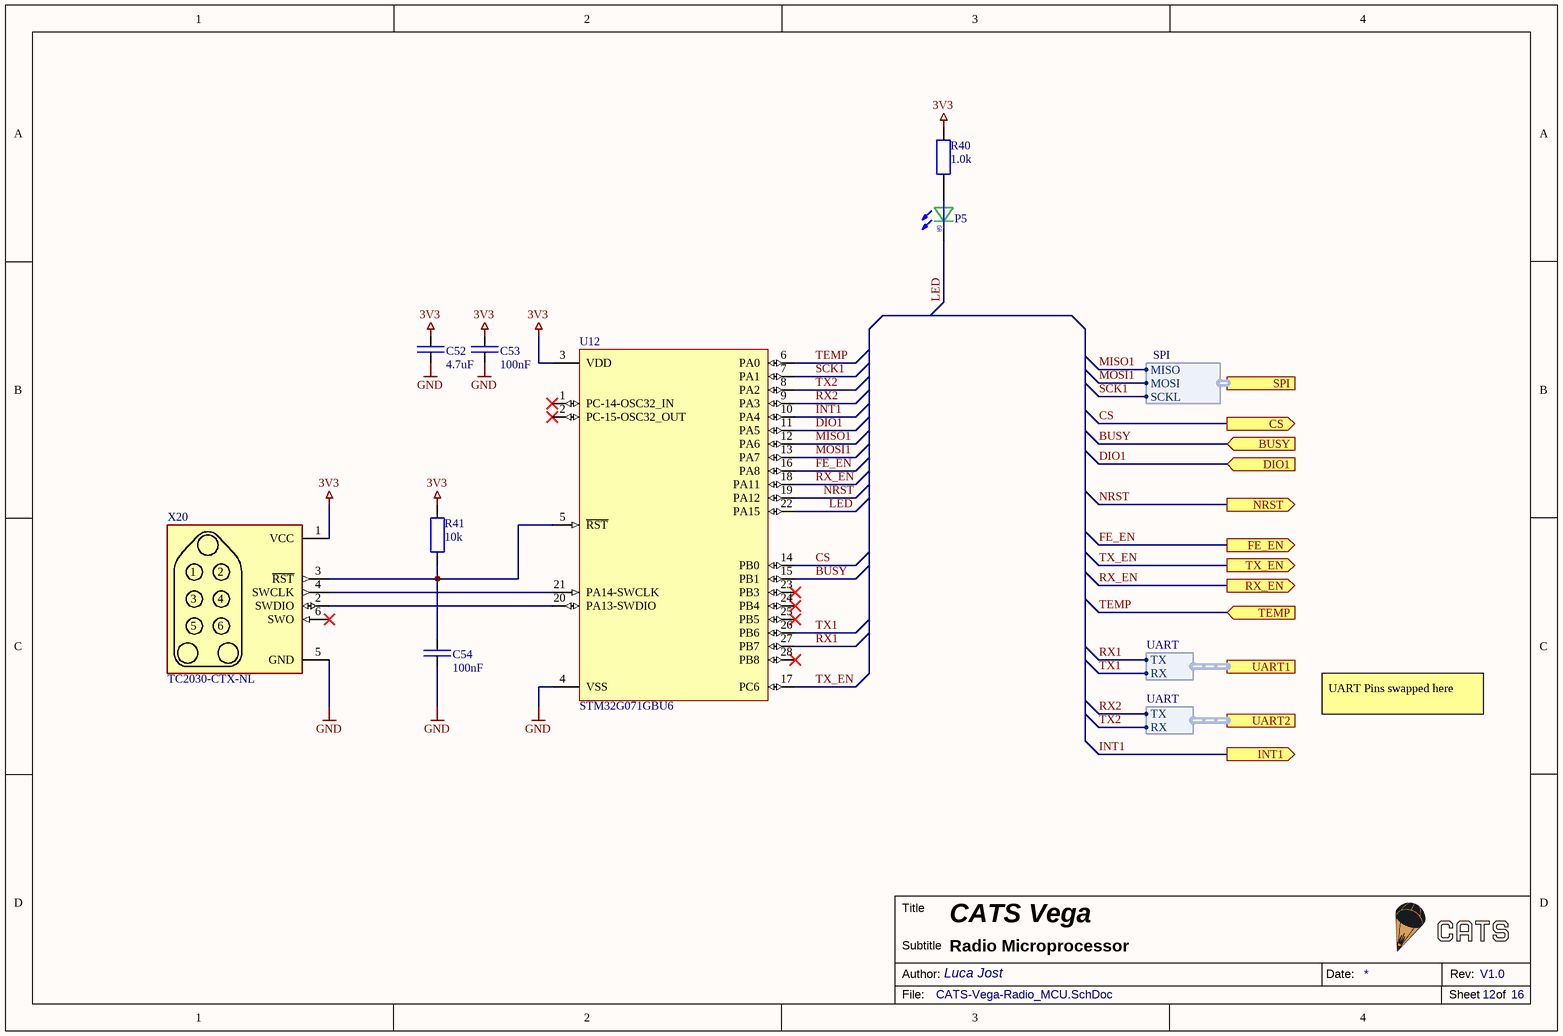
[diagram p11: CATS-Vega-Radio_MCU.SchDoc]

### Parts
C52  4.7uF  [SMD Keramikkondensator 0603]
C53  100nF  [SMD Keramikkondensator 0603]
C54  100nF  [SMD Keramikkondensator 0603]
P5  LED  [SMD LED 0603]  (value not drawn)
R40  1.0k  [SMD Widerstand 0603]
R41  10k  [SMD Widerstand 0603]
U12  STM32G071GBU6  [SMD IC QFN-28 4x4 0.5 Pitch]
X20  TC2030-CTX-NL  [SMD Connector TC2030]  (no BOM)

### Ports
BUSY (in), CS (out), DIO1 (in), FE_EN (out), INT1 (out), NRST (out), RX_EN (out), SPI (harness SPI), TEMP (in), TX_EN (out), UART1 (harness UART), UART2 (harness UART)

### Harnesses
SPI: SCKL, MOSI, MISO
UART: TX, RX

### Nets
3V3: C52.2 C53.2 R40.2 R41.2 U12.3(VDD) X20.1(VCC)
GND: C52.1 C53.1 C54.1 U12.4(VSS) X20.5(GND)
BUSY: U12.15(PB1) ; port BUSY
CS: U12.14(PB0) ; port CS
DIO1: U12.11(PA5) ; port DIO1
FE_EN: U12.16(PA8) ; port FE_EN
INT1: U12.10(PA4) ; port INT1
LED: P5.K U12.22(PA15)
MISO1: U12.12(PA6) ; port SPI.MISO
MOSI1: U12.13(PA7) ; port SPI.MOSI
NRST: U12.19(PA12) ; port NRST
RX1: U12.27(PB7) ; port UART1.TX
RX2: U12.9(PA3) ; port UART2.TX
RX_EN: U12.18(PA11) ; port RX_EN
SCK1: U12.7(PA1) ; port SPI.SCKL
TEMP: U12.6(PA0) ; port TEMP
TX1: U12.26(PB6) ; port UART1.RX
TX2: U12.8(PA2) ; port UART2.RX
TX_EN: U12.17(PC6) ; port TX_EN
NetC54_2: C54.2 R41.1 U12.5(~{RST}) X20.3(~{RST})
NetP5_A: P5.A R40.1
NetU12_20: U12.20(PA13-SWDIO) X20.2(SWDIO)
NetU12_21: U12.21(PA14-SWCLK) X20.4(SWCLK)

Not connected (* = marked no-connect by the designer): U12 1(PC-14-OSC32_IN)* 2(PC-15-OSC32_OUT)* 23(PB3)* 24(PB4)* 25(PB5)* 28(PB8)*; X20 6(SWO)*

### Notes on the sheet
- UART Pins swapped here
- Title
- Author:
- Subtitle
- Date:
- Rev:
- File:
- Sheet
- of
- (in symbol LED) GR

### Library data of the parts
C52 = E6 - 4.7uF: SMD Ceramic Capacitor E6; Unit Price: 0.0082; JLC: C19666
C53 C54 = E6 - 100nF: SMD Ceramic Capacitor E6; Unit Price: 0.0024; JLC: C1591
P5 = LED: Color LED; JLC: C434421; Unit Price: 0.01
R40 = E24 - 1.0k: SMD Chip Resistor E24; Unit Price: 0.001; JLC: C2907113
R41 = E24 - 10k: SMD Chip Resistor E24; Unit Price: 0.001; JLC: C99198
U12 = STM32G071GBU6: ARM® Cortex®-M0+ series Microcontroller IC 32-Bit 64MHz 128KB (128K x 8) FLASH 28-UFQFPN (4x4); Digikey: 497-18343-ND; JLC: C529347; ComponentLink1Description: Datasheet; ComponentLink1URL: https://media.digikey.com/pdf/Data%20Sheets/ST%20Microelectronics%20PDFS/STM32G071_Rev1_DS.pdf; Unit Price: 2.8446
X20 = TC2030-CTX-NL: Tag-Connect for ARM-Cortex (6-Pin)

## Sheet CATS-Vega-RF.SchDoc: CATS Vega
size A4; Author: Luca Jost; Revision: V1.0; SheetNumber: 13; SheetTotal: 16; Subtitle: RF
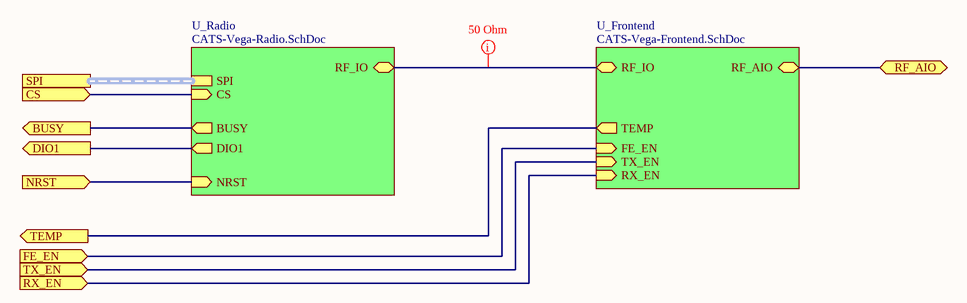
[diagram p12: CATS-Vega-RF.SchDoc]

### Sub-sheets
U_Frontend = CATS-Vega-Frontend.SchDoc: FE_EN (in), TX_EN (in), TEMP (out), RF_IO (bidir), RX_EN (in), RF_AIO (bidir)
U_Radio = CATS-Vega-Radio.SchDoc: SPI (harness SPI), CS (in), BUSY (out), DIO1 (out), RF_IO (bidir), NRST (in)

### Ports
BUSY (out), CS (in), DIO1 (out), FE_EN (in), NRST (in), RF_AIO (bidir), RX_EN (in), SPI (harness SPI), TEMP (out), TX_EN (in)

### Nets
BUSY: port BUSY, sheet U_Radio/BUSY
CS: port CS, sheet U_Radio/CS
DIO1: port DIO1, sheet U_Radio/DIO1
FE_EN: port FE_EN, sheet U_Frontend/FE_EN
NRST: port NRST, sheet U_Radio/NRST
RX_EN: port RX_EN, sheet U_Frontend/RX_EN
TEMP: port TEMP, sheet U_Frontend/TEMP
TX_EN: port TX_EN, sheet U_Frontend/TX_EN
NetFL1_3: port RF_AIO, sheet U_Frontend/RF_AIO
NetU3_5: sheet U_Frontend/RF_IO, sheet U_Radio/RF_IO

### Buses and harness runs
harness port SPI = sheet U_Radio/SPI

### Layout directives
rule Impedance Constraint [Min = 50.00    Max = 50.00    ]: NetU3_5

### Notes on the sheet
- Title
- Author:
- Subtitle
- Date:
- Rev:
- File:
- Sheet
- of

## Sheet CATS-Vega-Frontend.SchDoc: CATS Vega
size A4; Author: Luca Jost; Revision: V1.0; SheetNumber: 15; SheetTotal: 16; Subtitle: Front End
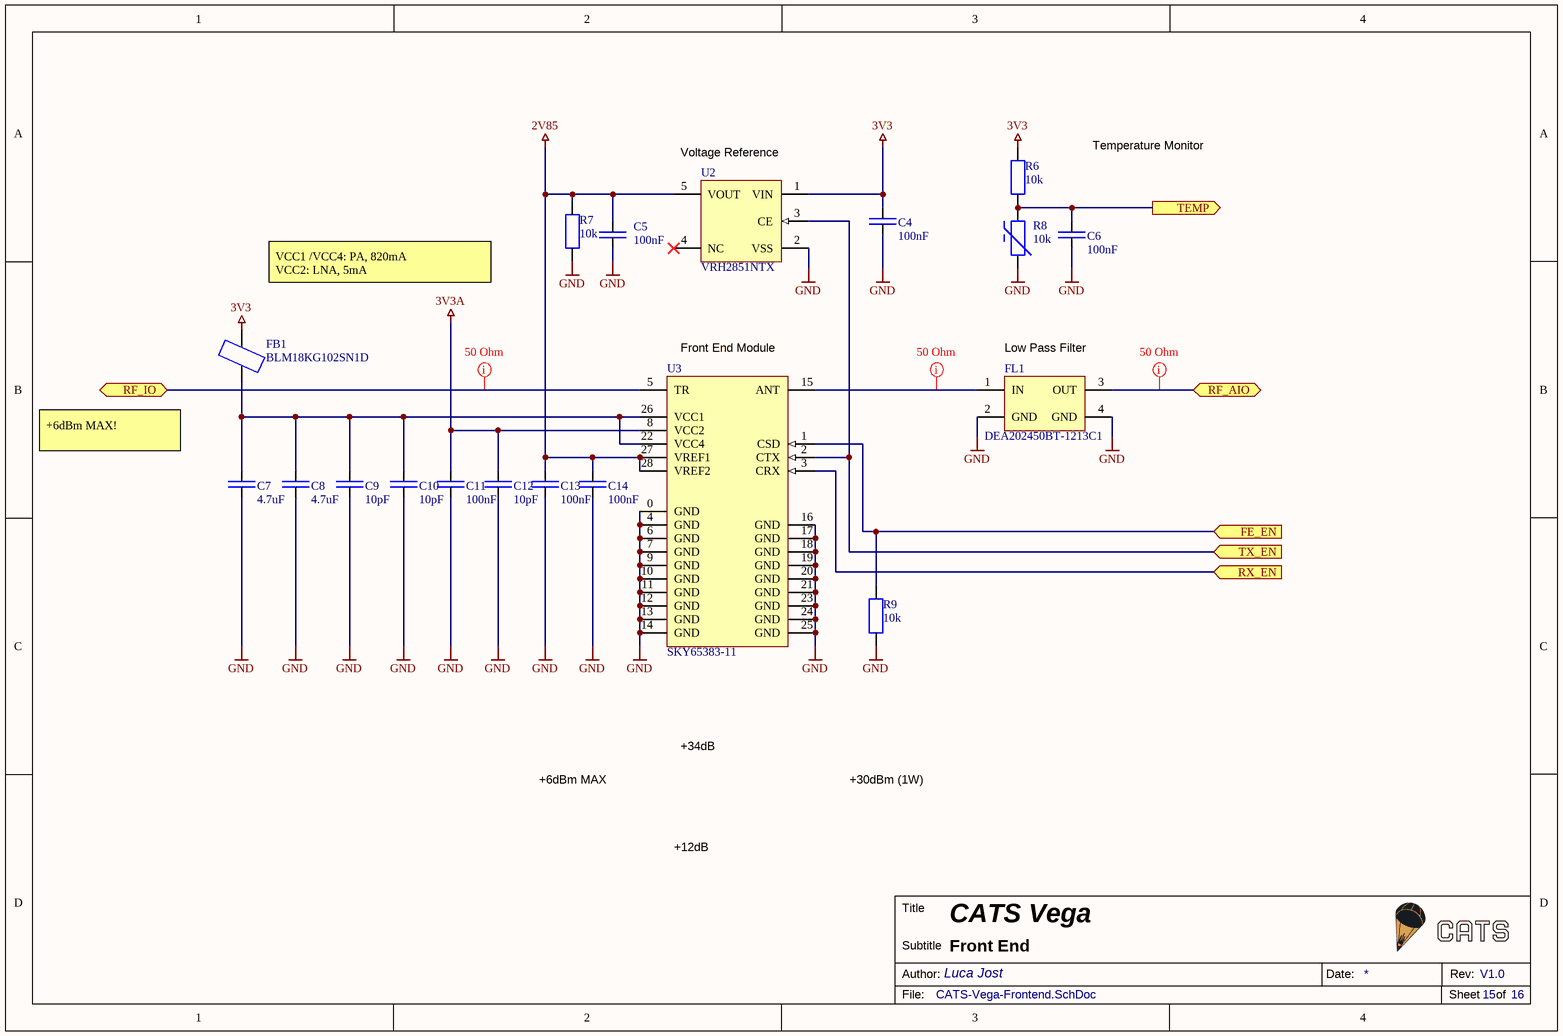
[diagram p13: CATS-Vega-Frontend.SchDoc]

### Parts
C4  100nF  [SMD Keramikkondensator 0603]
C5  100nF  [SMD Keramikkondensator 0603]
C6  100nF  [SMD Keramikkondensator 0603]
C7  4.7uF  [SMD Keramikkondensator 0603]
C8  4.7uF  [SMD Keramikkondensator 0603]
C9  10pF  [SMD Keramikkondensator 0603]
C10  10pF  [SMD Keramikkondensator 0603]
C11  100nF  [SMD Keramikkondensator 0603]
C12  10pF  [SMD Keramikkondensator 0603]
C13  100nF  [SMD Keramikkondensator 0603]
C14  100nF  [SMD Keramikkondensator 0603]
FB1  BLM18KG102SN1D  [SMD Ferrite Bead 0603]
FL1  DEA202450BT-1213C1  [SMD Filter DEA202450BT]
R6  10k  [SMD Widerstand 0603]
R7  10k  [SMD Widerstand 0603]
R8  10k  [SMD NTC 0603]
R9  10k  [SMD Widerstand 0603]
U2  VRH2851NTX  [SMD IC SOT-23-5]
U3  SKY65383-11  [SMD IC 28-MCM]

### Ports
FE_EN (in), RF_AIO (bidir), RF_IO (bidir), RX_EN (in), TEMP (out), TX_EN (in)

### Nets
2V85: C5.2 C13.2 C14.2 R7.2 U2.5(VOUT) U3.27(VREF1) U3.28(VREF2)
3V3: C4.2 FB1.2 R6.2 U2.1(VIN)
3V3A: C11.2 C12.2 U3.8(VCC2)
GND: C4.1 C5.1 C6.1 C7.1 C8.1 C9.1 C10.1 C11.1 C12.1 C13.1 C14.1 FL1.2(GND) FL1.4(GND) R7.1 R8.2 R9.1 U2.2(VSS) U3.0(GND) U3.4(GND) U3.6(GND) U3.7(GND) U3.9(GND) U3.10(GND) U3.11(GND) U3.12(GND) U3.13(GND) U3.14(GND) U3.16(GND) U3.17(GND) U3.18(GND) U3.19(GND) U3.20(GND) U3.21(GND) U3.23(GND) U3.24(GND) U3.25(GND)
FE_EN: R9.2 U3.1(CSD) ; port FE_EN
RX_EN: U3.3(CRX) ; port RX_EN
TEMP: C6.2 R6.1 R8.1 ; port TEMP
TX_EN: U2.3(CE) U3.2(CTX) ; port TX_EN
NetC7_2: C7.2 C8.2 C9.2 C10.2 FB1.1 U3.22(VCC4) U3.26(VCC1)
NetFL1_1: FL1.1(IN) U3.15(ANT)
NetFL1_3: FL1.3(OUT) ; port RF_AIO
NetU3_5: U3.5(TR) ; port RF_IO

Not connected (* = marked no-connect by the designer): U2 4(NC)*

### Layout directives
rule Impedance Constraint [Min = 50.00    Max = 50.00    ]; net class RF-Line 50: NetFL1_1, NetFL1_3, NetU3_5

### Notes on the sheet
- (near U2) Voltage Reference
- Temperature Monitor
- VCC1 /VCC4: PA, 820mA
  VCC2: LNA, 5mA
- (near U3) Front End Module
- (near FL1) Low Pass Filter
- +6dBm MAX!
- +6dBm MAX
- +34dB
- +30dBm (1W)
- +12dB
- Title
- Author:
- Subtitle
- Date:
- Rev:
- File:
- Sheet
- of

### Library data of the parts
C4-C6 C11 C13 C14 = E6 - 100nF: SMD Ceramic Capacitor E6; Unit Price: 0.0024; JLC: C1591
C7 C8 = E6 - 4.7uF: SMD Ceramic Capacitor E6; Unit Price: 0.0082; JLC: C19666
C9 C10 C12 = E6 - 10pF: SMD Ceramic Capacitor E6; Unit Price: 0.0055; JLC: C1634
FB1 = BLM18KG102SN1D: as FB2 on sheet CATS-Vega-USB; ComponentLink1Description: Datasheet; ComponentLink1URL: https://www.murata.com/en-us/products/productdata/8796738650142/ENFA0003.pdf; Digikey: 490-17349-1-ND; JLC: C42102; Unit Price: 0.0058
FL1 = DEA202450BT-1213C1: Multilayer Band Pass Filter 2400-2500MHz; ComponentLink1Description: Datasheet; ComponentLink1URL: https://datasheet.lcsc.com/lcsc/1811021613_TDK-DEA202450BT-1213C1_C307898.pdf; JLC: C307898; Digikey: 445-3969-2-ND; Mouser: 810-DEA22450BT1213C1; Unit Price: 0.1188
R6 R7 R9 = E24 - 10k: SMD Chip Resistor E24; Unit Price: 0.001; JLC: C99198
R8 = SDNT1608X103F3450FTF: NTC 10kΩ -55℃~+125℃ 0.31mA 100mW ±1% 3450K; JLC: C95953; Unit Price: 0.0192; ComponentLink1Description: Datasheet; ComponentLink1URL: https://datasheet.lcsc.com/lcsc/2110081230_Sunlord-SDNT1608X103F3450FTF_C95953.pdf
U2 = VRH2851NTX: Linear Voltage Regulator IC Positive Fixed 1 Output  250mA SOT-23-5 2.85V; ComponentLink1Description: Datasheet; ComponentLink1URL: https://datasheet.lcsc.com/lcsc/2007221906_AnaSem-VRH2851NTX_C697994.pdf; JLC: C697994; Unit Price: 0.0585
U3 = SKY65383-11: 2400 to 2483 MHz Transmit/Receive / Front-End Module +30dBm; ComponentLink1Description: Datasheet; ComponentLink1URL: https://www.skyworksinc.com/-/media/SkyWorks/Documents/Products/2901-3000/SKY65383-11_202668G.pdf; Digikey: 863-1798-1-ND; Mouser: 873-SKY65383-11; Unit Price: 4.16720

## Sheet CATS-Vega-Radio.SchDoc: CATS Vega
size A4; Author: Luca Jost; Revision: V1.0; SheetNumber: 14; SheetTotal: 16; Subtitle: Radio
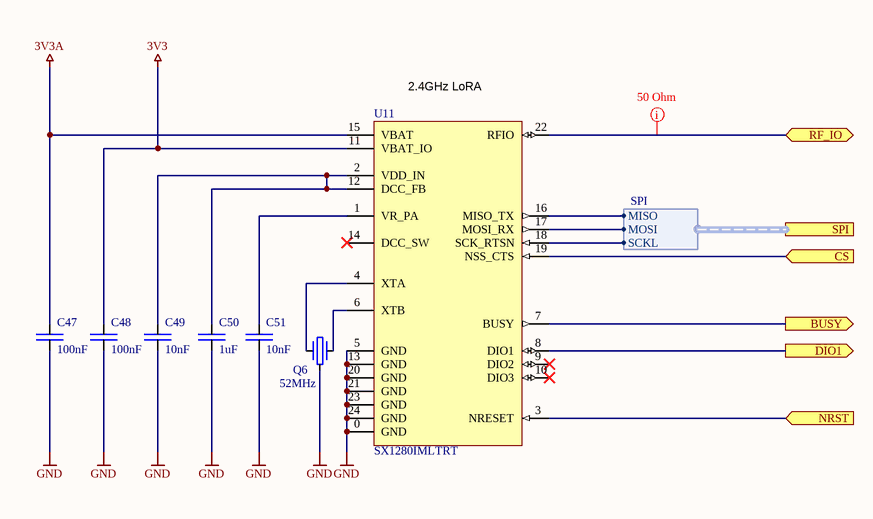
[diagram p14: CATS-Vega-Radio.SchDoc]

### Parts
C47  100nF  [SMD Keramikkondensator 0603]
C48  100nF  [SMD Keramikkondensator 0603]
C49  10nF  [SMD Keramikkondensator 0603]
C50  1uF  [SMD Keramikkondensator 0603]
C51  10nF  [SMD Keramikkondensator 0603]
Q6  52MHz  [SMD Crystal 2520]
U11  SX1280IMLTRT  [SMD IC QFN-24]

### Ports
BUSY (out), CS (in), DIO1 (out), NRST (in), RF_IO (bidir), SPI (harness SPI)

### Harnesses
SPI: SCKL, MOSI, MISO

### Nets
3V3: C48.2 U11.11(VBAT_IO)
3V3A: C47.2 U11.15(VBAT)
GND: C47.1 C48.1 C49.1 C50.1 C51.1 Q6.3 U11.0(GND) U11.5(GND) U11.13(GND) U11.20(GND) U11.21(GND) U11.23(GND) U11.24(GND)
BUSY: U11.7(BUSY) ; port BUSY
CS: U11.19(NSS_CTS) ; port CS
DIO1: U11.8(DIO1) ; port DIO1
MISO1: U11.16(MISO_TX) ; port SPI.MISO
MOSI1: U11.17(MOSI_RX) ; port SPI.MOSI
NRST: U11.3(NRESET) ; port NRST
SCK1: U11.18(SCK_RTSN) ; port SPI.SCKL
NetC49_2: C49.2 C50.2 U11.2(VDD_IN) U11.12(DCC_FB)
NetC51_2: C51.2 U11.1(VR_PA)
NetQ6_1: Q6.1 U11.4(XTA)
NetQ6_2: Q6.2 U11.6(XTB)
NetU3_5: U11.22(RFIO) ; port RF_IO

Not connected (* = marked no-connect by the designer): U11 9(DIO2)* 10(DIO3)* 14(DCC_SW)*

### Layout directives
rule Impedance Constraint [Min = 50.00    Max = 50.00    ]; net class RF-Line 50: NetU3_5

### Notes on the sheet
- (near U11) 2.4GHz LoRA
- Title
- Author:
- Subtitle
- Date:
- Rev:
- File:
- Sheet
- of

### Library data of the parts
C47 C48 = E6 - 100nF: SMD Ceramic Capacitor E6; Unit Price: 0.0024; JLC: C1591
C49 C51 = E6 - 10nF: SMD Ceramic Capacitor E6; Unit Price: 0.0015; JLC: C1589
C50 = E6 - 1uF: SMD Ceramic Capacitor E6; Unit Price: 0.0047; JLC: C15849
Q6 = Crystal 52MHz - 2520: 52Mhz Ceramic 2.5 x 2.0mm SMD 10pF 60Ω ±10ppm; JLC: C963550; ComponentLink1Description: Datasheet; ComponentLink1URL: https://datasheet.lcsc.com/lcsc/2012211835_WTL-WTL2M75523TW_C963550.pdf; Unit Price: 0.2466; Digikey: 50-ECS-520-8-36B-CTN-TR-ND; Mouser: 520-520-8-36B-CTN-TR
U11 = SX1280IMLTRT: Long Range, Low Power, 2.4 GHz / Transceiver with Ranging Capability; ComponentLink1Description: Datasheet; ComponentLink1URL: https://media.digikey.com/pdf/Data%20Sheets/Semtech%20PDFs/SX1280-81_Rev3.2_Mar2020.pdf; Digikey: SX1280IMLTRTCT-ND; JLC: C125969; Unit Price: 5.50000

## Sheet CATS-Vega-GNSS.SchDoc: CATS Vega
size A4; Author: Luca Jost; Revision: V1.0; SheetNumber: 16; SheetTotal: 16; Subtitle: GNSS
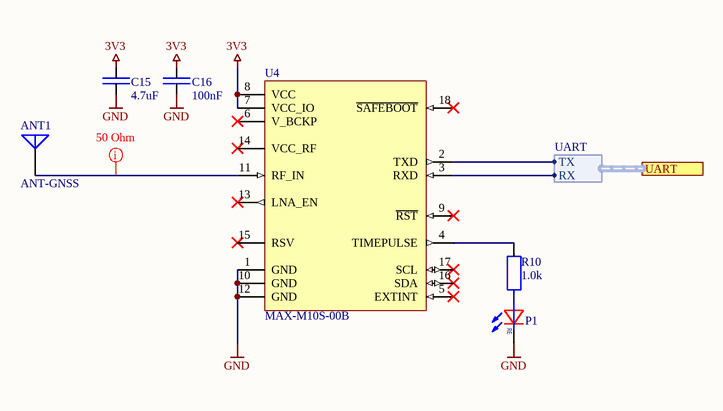
[diagram p15: CATS-Vega-GNSS.SchDoc]

### Parts
ANT1  ANT-GNSS  [THT Antenna GNSS 18x18]
C15  4.7uF  [SMD Keramikkondensator 0603]
C16  100nF  [SMD Keramikkondensator 0603]
P1  LED  [SMD LED 0603]  (value not drawn)
R10  1.0k  [SMD Widerstand 0603]
U4  MAX-M10S-00B  [SMD MAX-8]

### Ports
UART (harness UART)

### Harnesses
UART: TX, RX

### Nets
3V3: C15.2 C16.2 U4.7(VCC_IO) U4.8(VCC)
GND: C15.1 C16.1 P1.K U4.1(GND) U4.10(GND) U4.12(GND)
RX1: U4.2(TXD) ; port UART.TX
TX1: U4.3(RXD) ; port UART.RX
NetANT1_1: ANT1.1 U4.11(RF_IN)
NetP1_A: P1.A R10.1
NetR10_2: R10.2 U4.4(TIMEPULSE)

Not connected (* = marked no-connect by the designer): U4 5(EXTINT)* 6(V_BCKP)* 9(~{RST})* 13(LNA_EN)* 14(VCC_RF)* 15(RSV)* 16(SDA)* 17(SCL)* 18(~{SAFEBOOT})*

### Layout directives
rule Impedance Constraint [Min = 50.00    Max = 50.00    ]; net class RF-Line 50: NetANT1_1

### Notes on the sheet
- Title
- Author:
- Subtitle
- Date:
- Rev:
- File:
- Sheet
- of
- (in symbol LED) RE

### Library data of the parts
ANT1 = ANT-GNSS: 1.575GHz, 1.602GHz Beidou, Galileo, GLONASS, GNSS, GPS Ceramic Patch RF Antenna 1.567GHz ~ 1.609GHz 5.1dBi, 2.8dBi, 4dBi Pin Adhesive; ComponentLink1Description: Datasheet; ComponentLink1URL: https://abracon.com/patchantenna/APAE1575R1820ABDC1-T.pdf; Digikey: 343-ANT-GNSSCP-TH18L1-ND; Mouser: 712-ANTGNSSCP-TH18L1; Unit Price: 1.63
C15 = E6 - 4.7uF: SMD Ceramic Capacitor E6; Unit Price: 0.0082; JLC: C19666
C16 = E6 - 100nF: SMD Ceramic Capacitor E6; Unit Price: 0.0024; JLC: C1591
P1 = LED: Color LED; JLC: C84263; Unit Price: 0.01
R10 = E24 - 1.0k: SMD Chip Resistor E24; Unit Price: 0.001; JLC: C2907113
U4 = MAX-M10S-00B: u-blox 8 GNSS modules; ComponentLink1Description: Datasheet; ComponentLink1URL: https://content.u-blox.com/sites/default/files/MAX-M10S_DataSheet_UBX-20035208.pdf; Digikey: 672-MAX-M10S-00BTR-ND; Unit Price: 14.16; Mouser: 377-MAX-M10S-00B

## Nets that join several sheets
3V3: CATS-Vega-IMU (C17.2 C18.2 U5.5 U5.8), CATS-Vega-Baro (C3.2 U1.1), CATS-Vega-MCU (17 pins), CATS-Vega-Pyro_Enable (C45.2 R37.2 U10.5), CATS-Vega-Storage (C55.2 U13.3 U13.7 U13.8), CATS-Vega-PM (6 pins), CATS-Vega-Telemetry (FB3.2), CATS-Vega-Radio_MCU (6 pins), CATS-Vega-Frontend (C4.2 FB1.2 R6.2 U2.1), CATS-Vega-Radio (C48.2 U11.11), CATS-Vega-GNSS (C15.2 C16.2 U4.7 U4.8)
3V3A: CATS-Vega-Telemetry (FB3.1), CATS-Vega-Frontend (C11.2 C12.2 U3.8), CATS-Vega-Radio (C47.2 U11.15)
5V: CATS-Vega-Overview (5 pins), CATS-Vega-MCU (C29.2 LS1.1), CH1 (U9_CH1.5), CH2 (U9_CH2.5), CATS-Vega-PM (6 pins)
GND: CATS-Vega-Overview (9 pins), CATS-Vega-IMU (6 pins), CATS-Vega-Baro (C3.1 U1.2 U1.3), CATS-Vega-MCU (20 pins), CH1 (9 pins), CH2 (9 pins), CATS-Vega-USB (10 pins), CATS-Vega-Pyro_Enable (5 pins), CATS-Vega-Storage (C55.1 U13.4), CATS-Vega-PM (14 pins), CATS-Vega-Radio_MCU (5 pins), CATS-Vega-Frontend (36 pins), CATS-Vega-Radio (13 pins), CATS-Vega-GNSS (6 pins)
VBAT: CATS-Vega-Pyro_Enable (Q4.S R34.2 R35.2), CATS-Vega-PM (6 pins)
VBUS: CATS-Vega-USB (FB2.1 R24.1 X15.1), CATS-Vega-PM (D5.A)
BUSY: CATS-Vega-Radio_MCU (U12.15), CATS-Vega-Radio (U11.7)
CS: CATS-Vega-Radio_MCU (U12.14), CATS-Vega-Radio (U11.19)
CS_BARO: CATS-Vega-Baro (U1.4 U1.5), CATS-Vega-MCU (U6.19)
CS_IMU: CATS-Vega-IMU (U5.12), CATS-Vega-MCU (U6.18)
DIO1: CATS-Vega-Radio_MCU (U12.11), CATS-Vega-Radio (U11.8)
FE_EN: CATS-Vega-Radio_MCU (U12.16), CATS-Vega-Frontend (R9.2 U3.1)
FLASH_CS: CATS-Vega-MCU (U6.25), CATS-Vega-Storage (U13.1)
INT1: CATS-Vega-MCU (U6.29), CATS-Vega-Radio_MCU (U12.10)
IO1: CATS-Vega-Overview (R1.1), CATS-Vega-MCU (U6.43)
MISO1: CATS-Vega-Radio_MCU (U12.12), CATS-Vega-Radio (U11.16)
MOSI1: CATS-Vega-Radio_MCU (U12.13), CATS-Vega-Radio (U11.17)
NetC30_2: CATS-Vega-Overview (X1.4), CATS-Vega-PM (C30.2 D3.A X7.1)
NetFL1_3: CATS-Vega-Overview (X5.1), CATS-Vega-Frontend (FL1.3)
NetU3_5: CATS-Vega-Frontend (U3.5), CATS-Vega-Radio (U11.22)
NRST: CATS-Vega-Radio_MCU (U12.19), CATS-Vega-Radio (U11.3)
PH1: CATS-Vega-Overview (X2.2 X2.4), CH1 (C42_CH1.2 C43_CH1.2), CH2 (C42_CH2.2 C43_CH2.2), CATS-Vega-Pyro_Enable (Q4.D R34.1)
PL1: CATS-Vega-Overview (X2.1), CH1 (F3_CH1.1 JP1_CH1.1 R28_CH1.2 R29_CH1.2)
PL2: CATS-Vega-Overview (X2.3), CH2 (F3_CH2.1 JP1_CH2.1 R28_CH2.2 R29_CH2.2)
PYRO1: CATS-Vega-MCU (U6.45), CH1 (R32_CH1.2 U9_CH1.3)
PYRO2: CATS-Vega-MCU (U6.46), CH2 (R32_CH2.2 U9_CH2.3)
PYRO_EN: CATS-Vega-MCU (U6.20), CATS-Vega-Pyro_Enable (R39.2 U10.2 X17.1)
RX1: CATS-Vega-Radio_MCU (U12.27), CATS-Vega-GNSS (U4.2)
RX2: CATS-Vega-MCU (U6.30), CATS-Vega-Radio_MCU (U12.9)
RX_EN: CATS-Vega-Radio_MCU (U12.18), CATS-Vega-Frontend (U3.3)
SCK1: CATS-Vega-Radio_MCU (U12.7), CATS-Vega-Radio (U11.18)
SERVO1: CATS-Vega-Overview (R4.1), CATS-Vega-MCU (U6.40)
SERVO2: CATS-Vega-Overview (R5.1), CATS-Vega-MCU (U6.41)
SPI1_MISO: CATS-Vega-IMU (U5.1), CATS-Vega-Baro (U1.6), CATS-Vega-MCU (U6.16)
SPI1_MOSI: CATS-Vega-IMU (U5.14), CATS-Vega-Baro (U1.7), CATS-Vega-MCU (U6.17)
SPI1_SCK: CATS-Vega-IMU (U5.13), CATS-Vega-Baro (U1.8), CATS-Vega-MCU (U6.15)
SPI2_MISO: CATS-Vega-MCU (U6.27), CATS-Vega-Storage (U13.2)
SPI2_MOSI: CATS-Vega-MCU (U6.28), CATS-Vega-Storage (U13.5)
SPI2_SCK: CATS-Vega-MCU (U6.21), CATS-Vega-Storage (U13.6)
TEMP: CATS-Vega-Radio_MCU (U12.6), CATS-Vega-Frontend (C6.2 R6.1 R8.1)
TX1: CATS-Vega-Radio_MCU (U12.26), CATS-Vega-GNSS (U4.3)
TX2: CATS-Vega-MCU (U6.31), CATS-Vega-Radio_MCU (U12.8)
TX_EN: CATS-Vega-Radio_MCU (U12.17), CATS-Vega-Frontend (U2.3 U3.2)
UART2_RX: CATS-Vega-Overview (R3.1), CATS-Vega-MCU (U6.13)
UART2_TX: CATS-Vega-Overview (R2.1), CATS-Vega-MCU (U6.12)
USB_DET: CATS-Vega-MCU (U6.38), CATS-Vega-USB (R24.2 R27.1)
USB_N: CATS-Vega-MCU (U6.32), CATS-Vega-USB (R23.2)
USB_P: CATS-Vega-MCU (U6.33), CATS-Vega-USB (R22.2)
V_BAT: CATS-Vega-MCU (U6.10), CATS-Vega-PM (C36.2 R16.1 R18.2 X11.1)
V_PYRO1: CATS-Vega-MCU (U6.14), CH1 (C44_CH1.2 R29_CH1.1 R33_CH1.2 X16_CH1.1)
V_PYRO2: CATS-Vega-MCU (U6.11), CH2 (C44_CH2.2 R29_CH2.1 R33_CH2.2 X16_CH2.1)